# Altium schematic sheet TRISTATE_BANK.SchDoc
size 762 x 381 mm
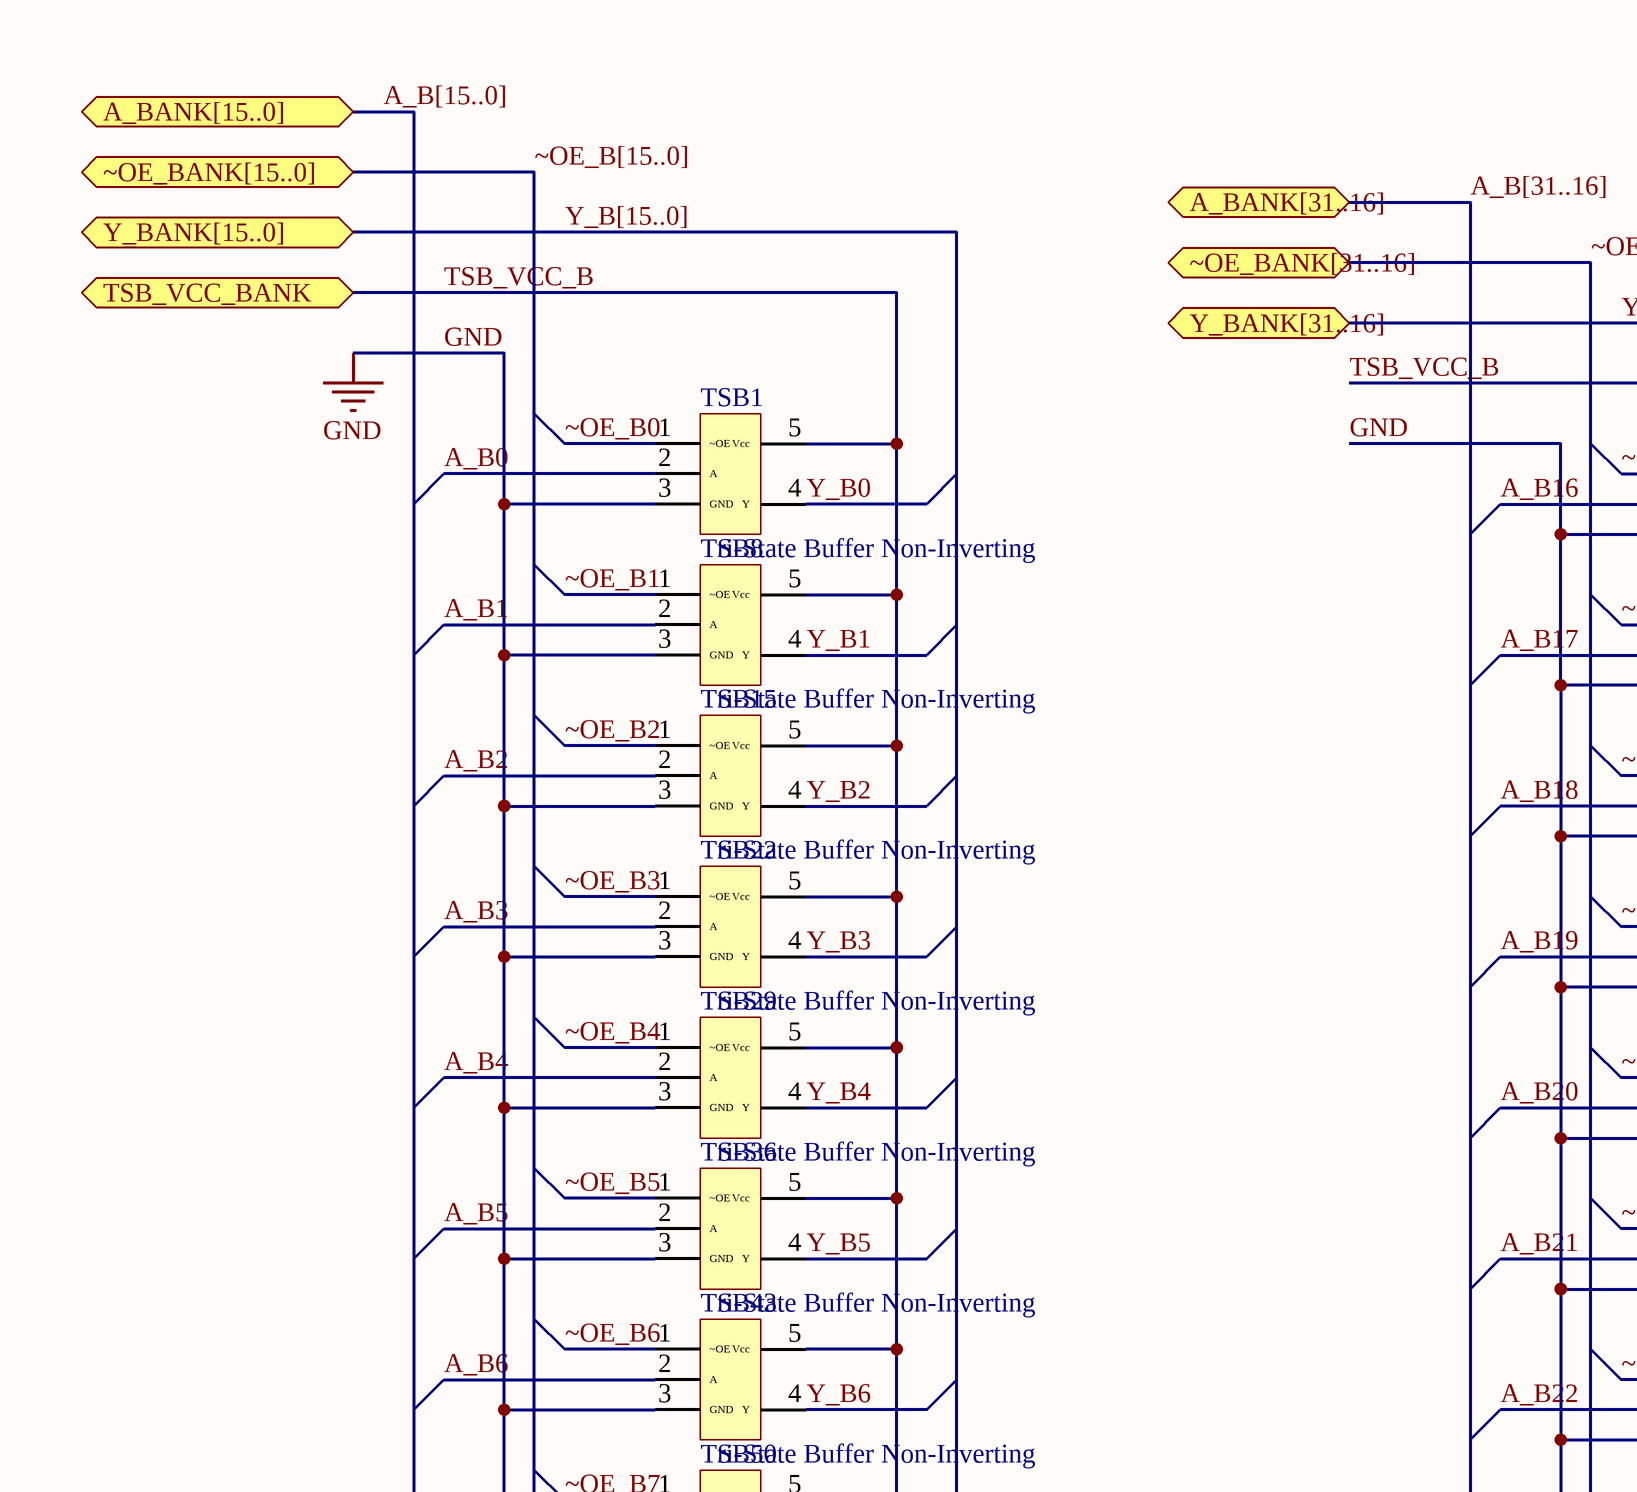
[diagram p0: TRISTATE_BANK.SchDoc, top column 1 of 5]
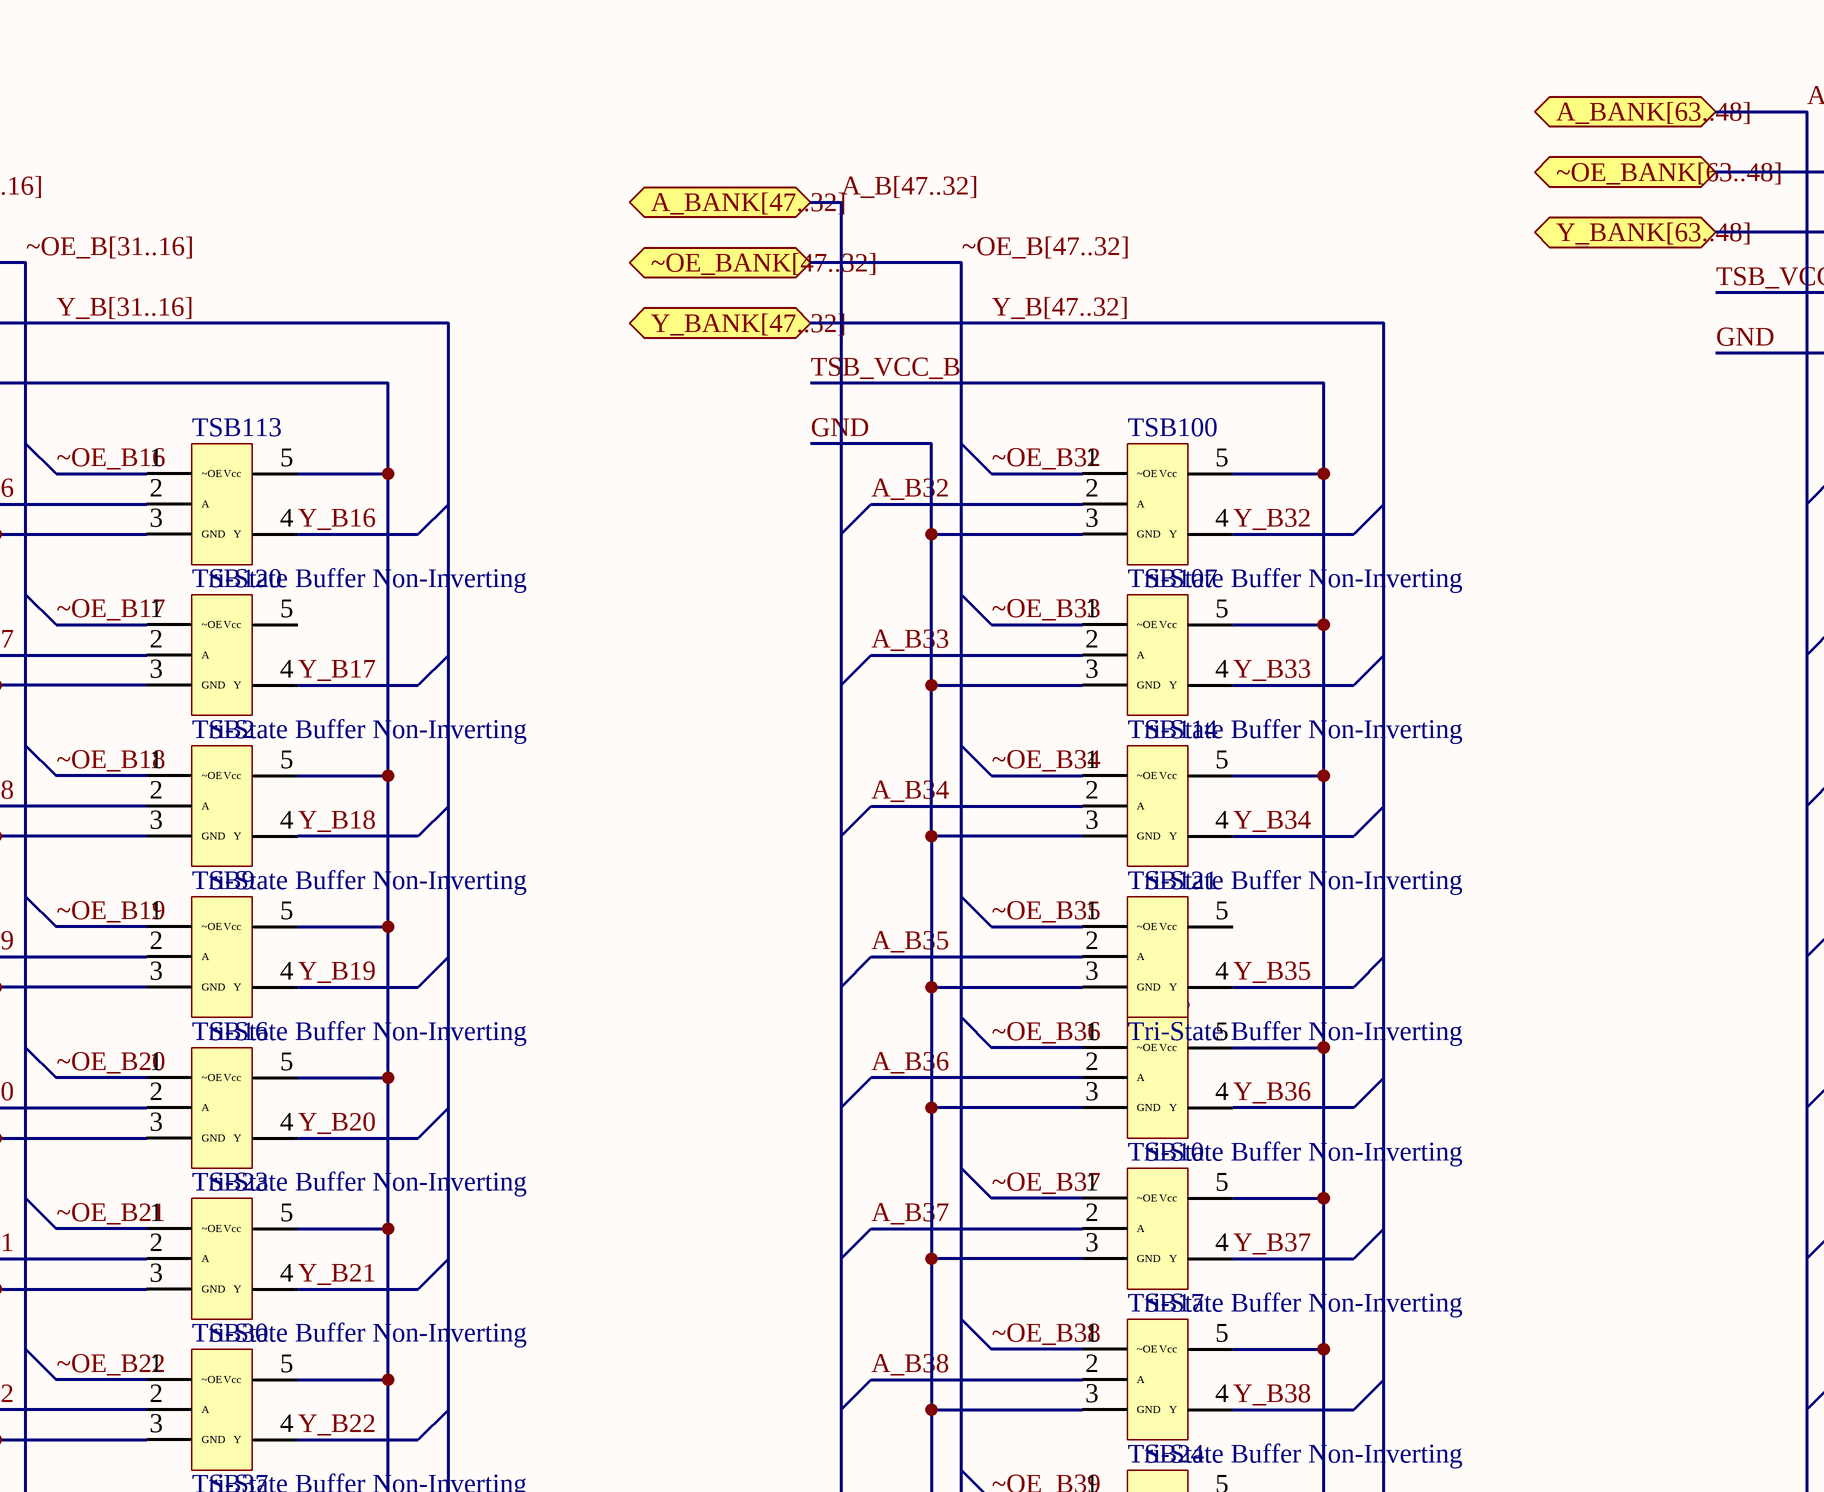
[diagram p1: TRISTATE_BANK.SchDoc, top column 2 of 5]
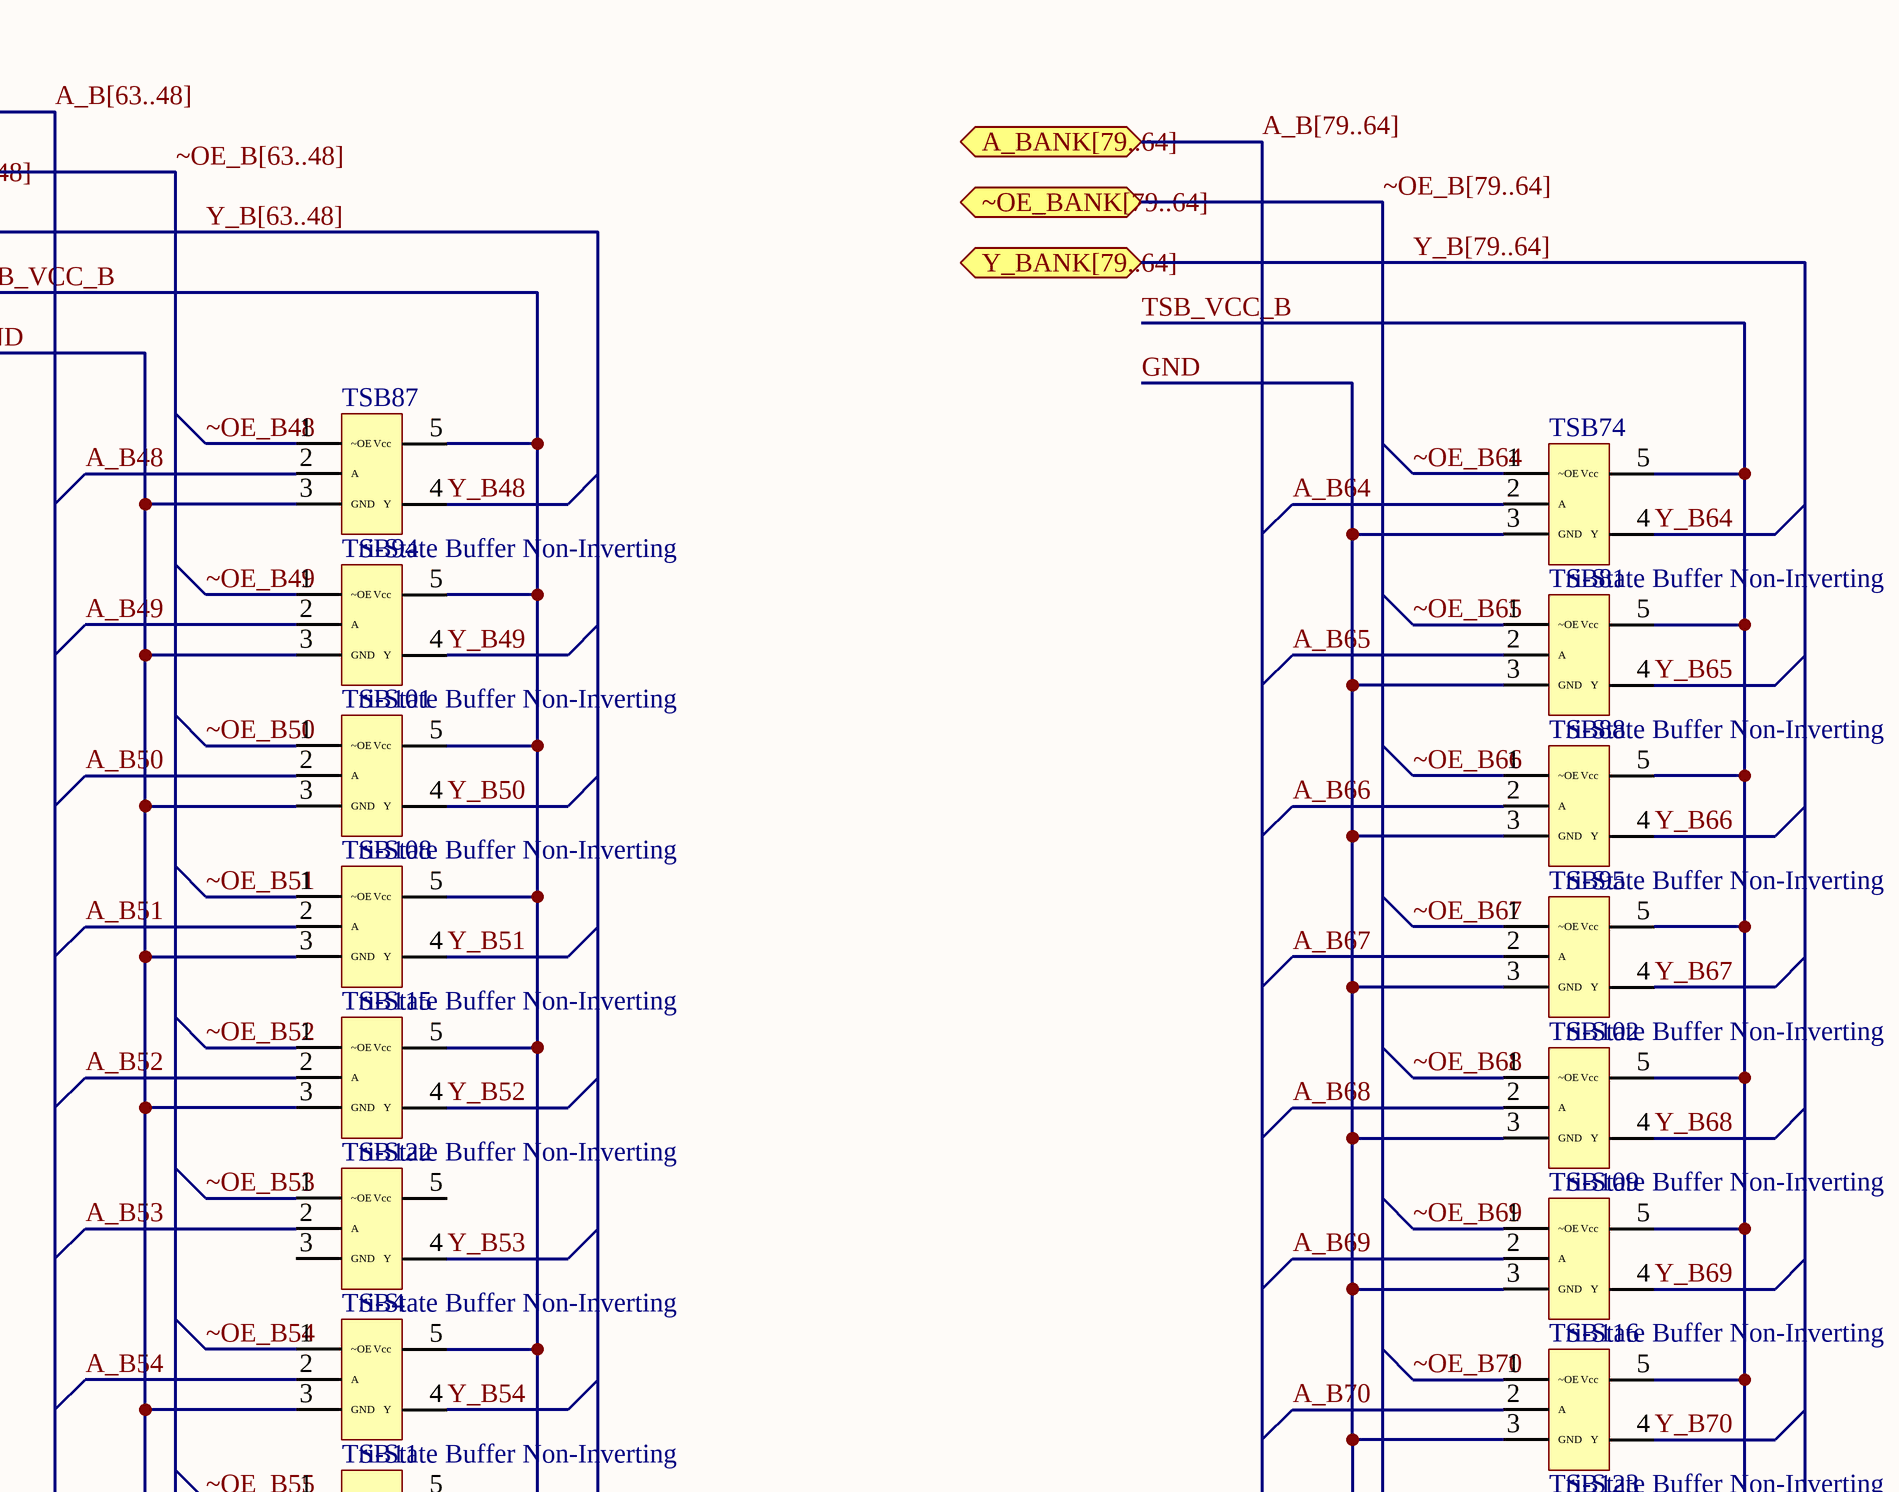
[diagram p2: TRISTATE_BANK.SchDoc, top column 3 of 5]
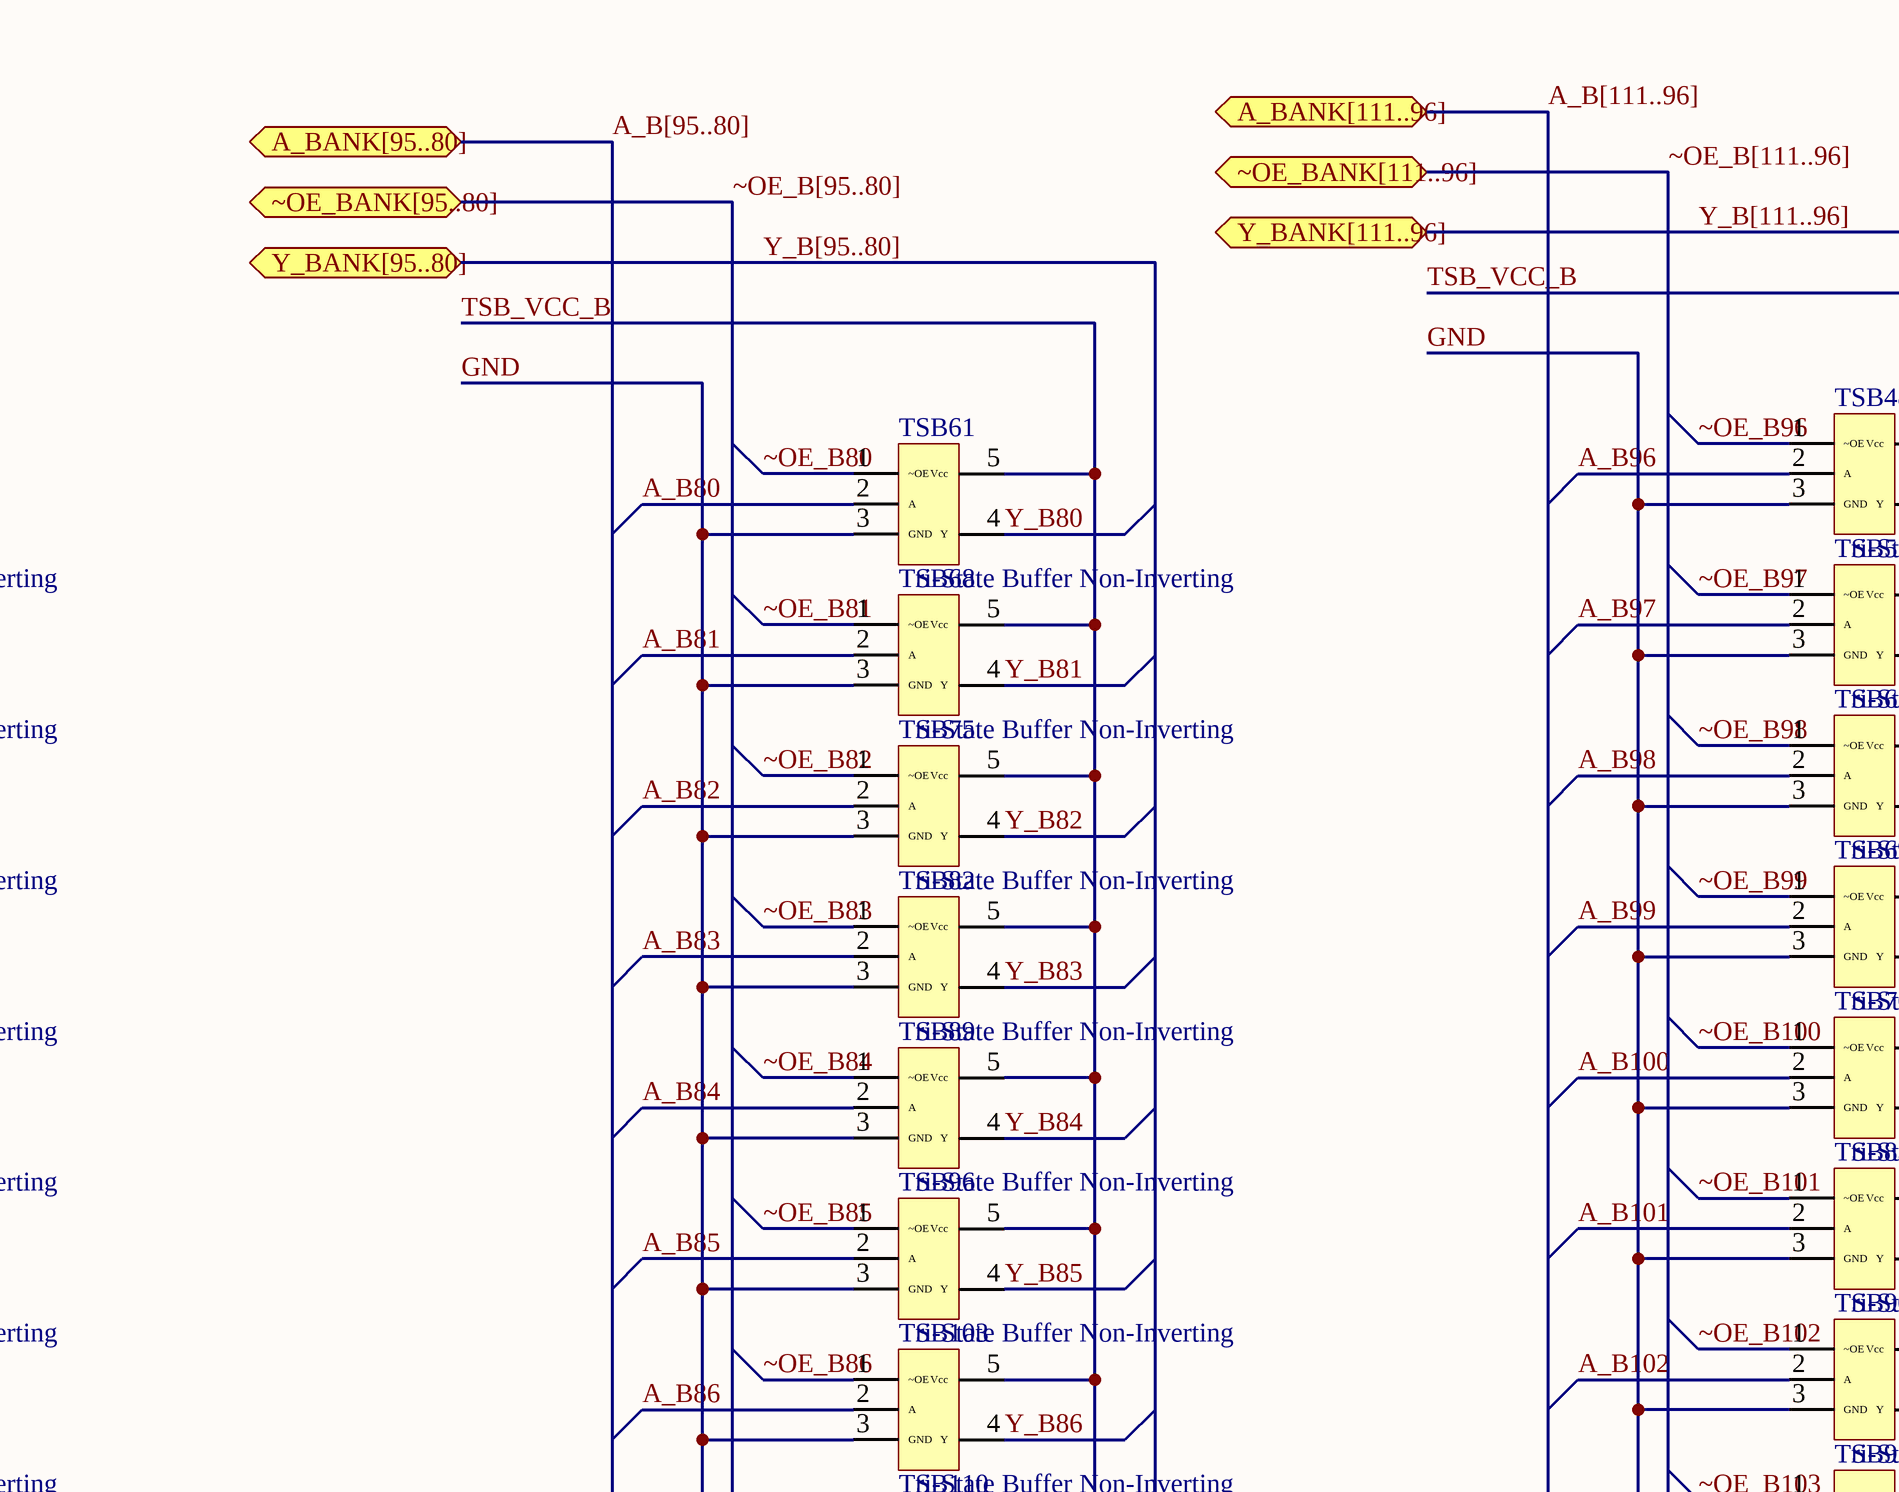
[diagram p3: TRISTATE_BANK.SchDoc, top column 4 of 5]
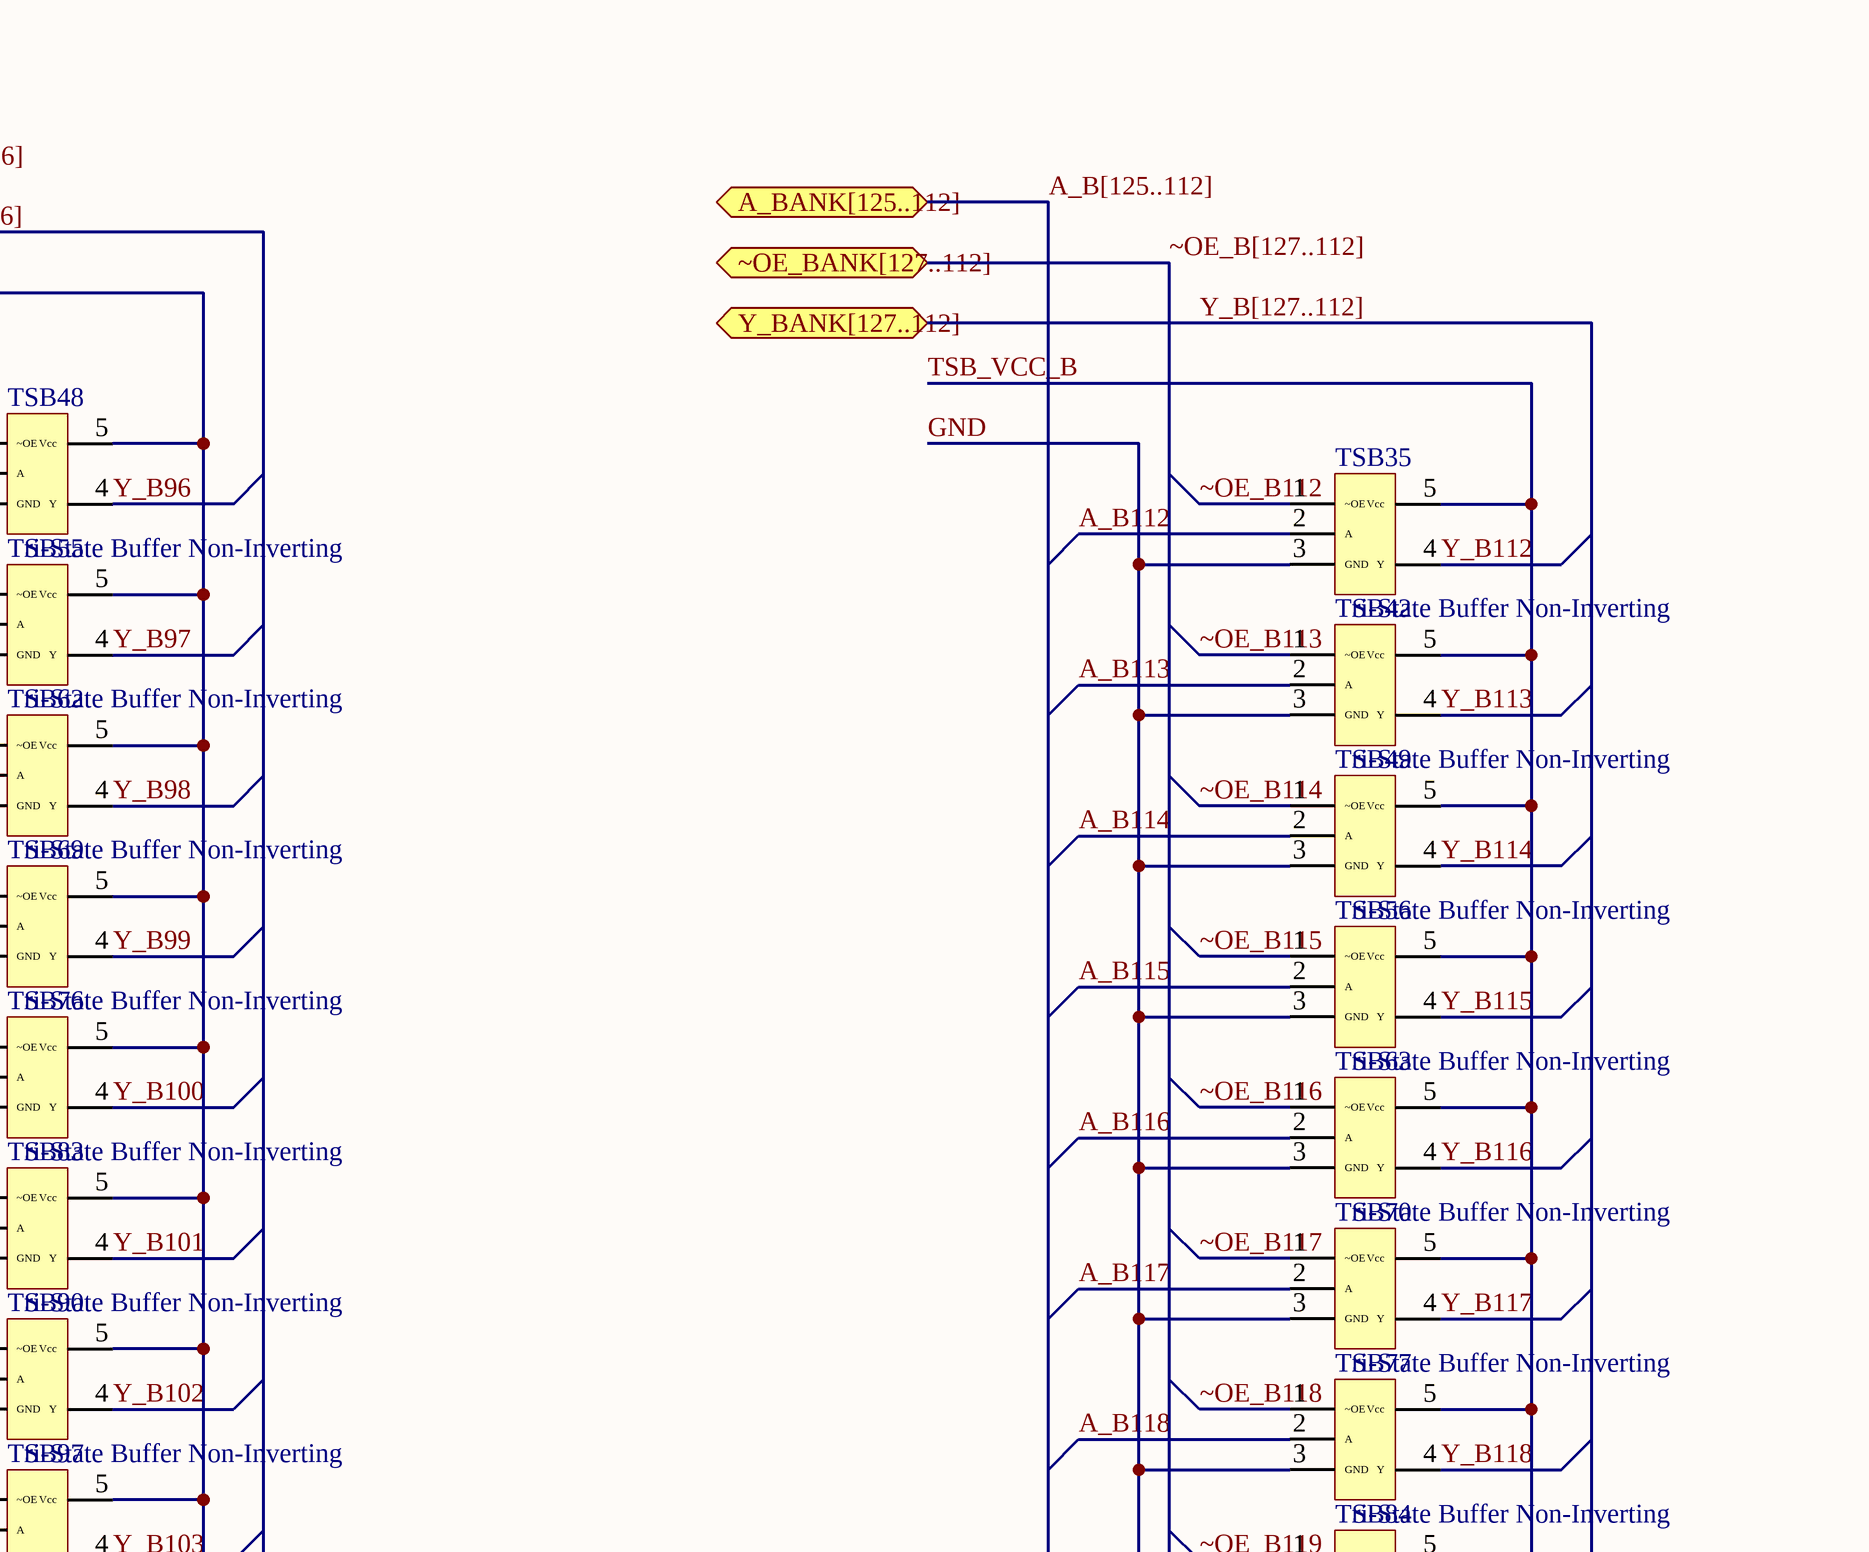
[diagram p4: TRISTATE_BANK.SchDoc, top column 5 of 5]
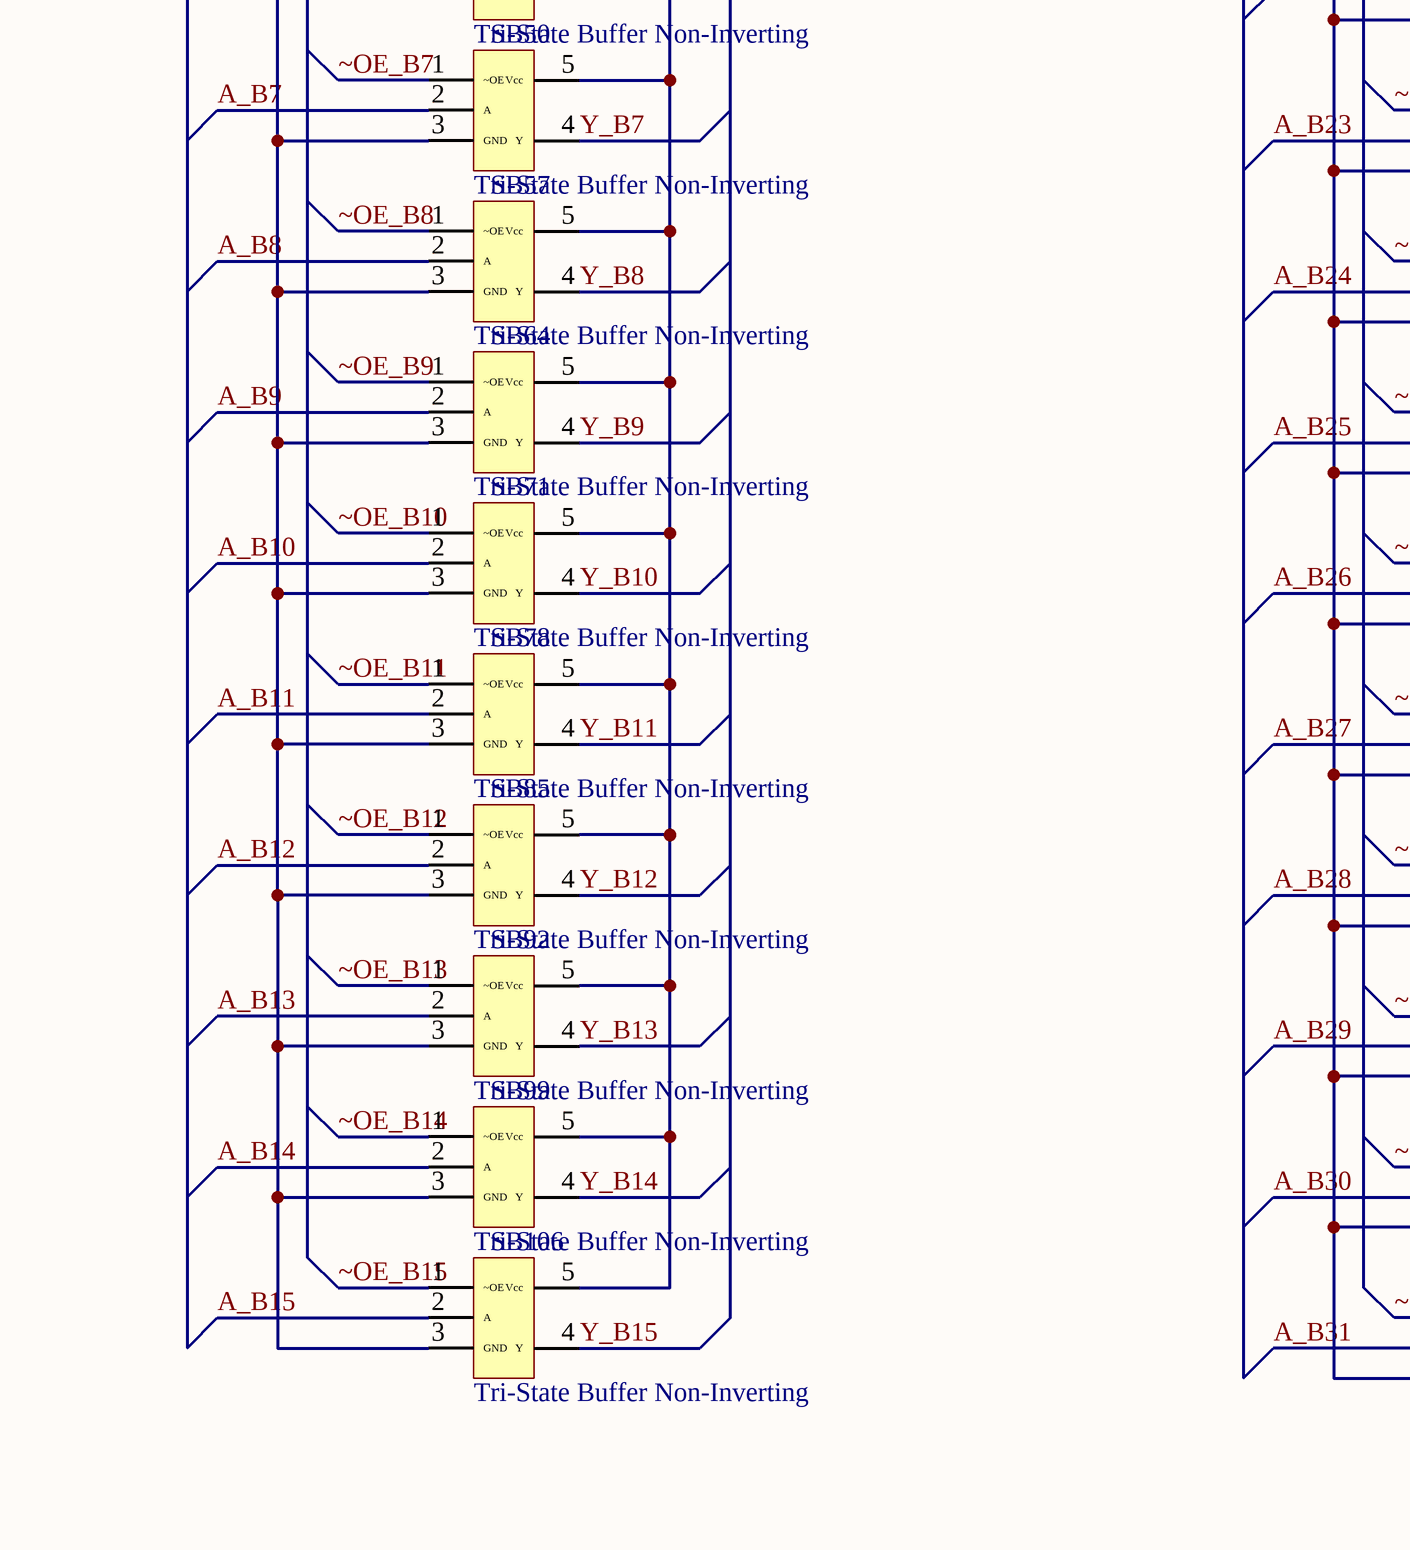
[diagram p5: TRISTATE_BANK.SchDoc, bottom column 1 of 5]
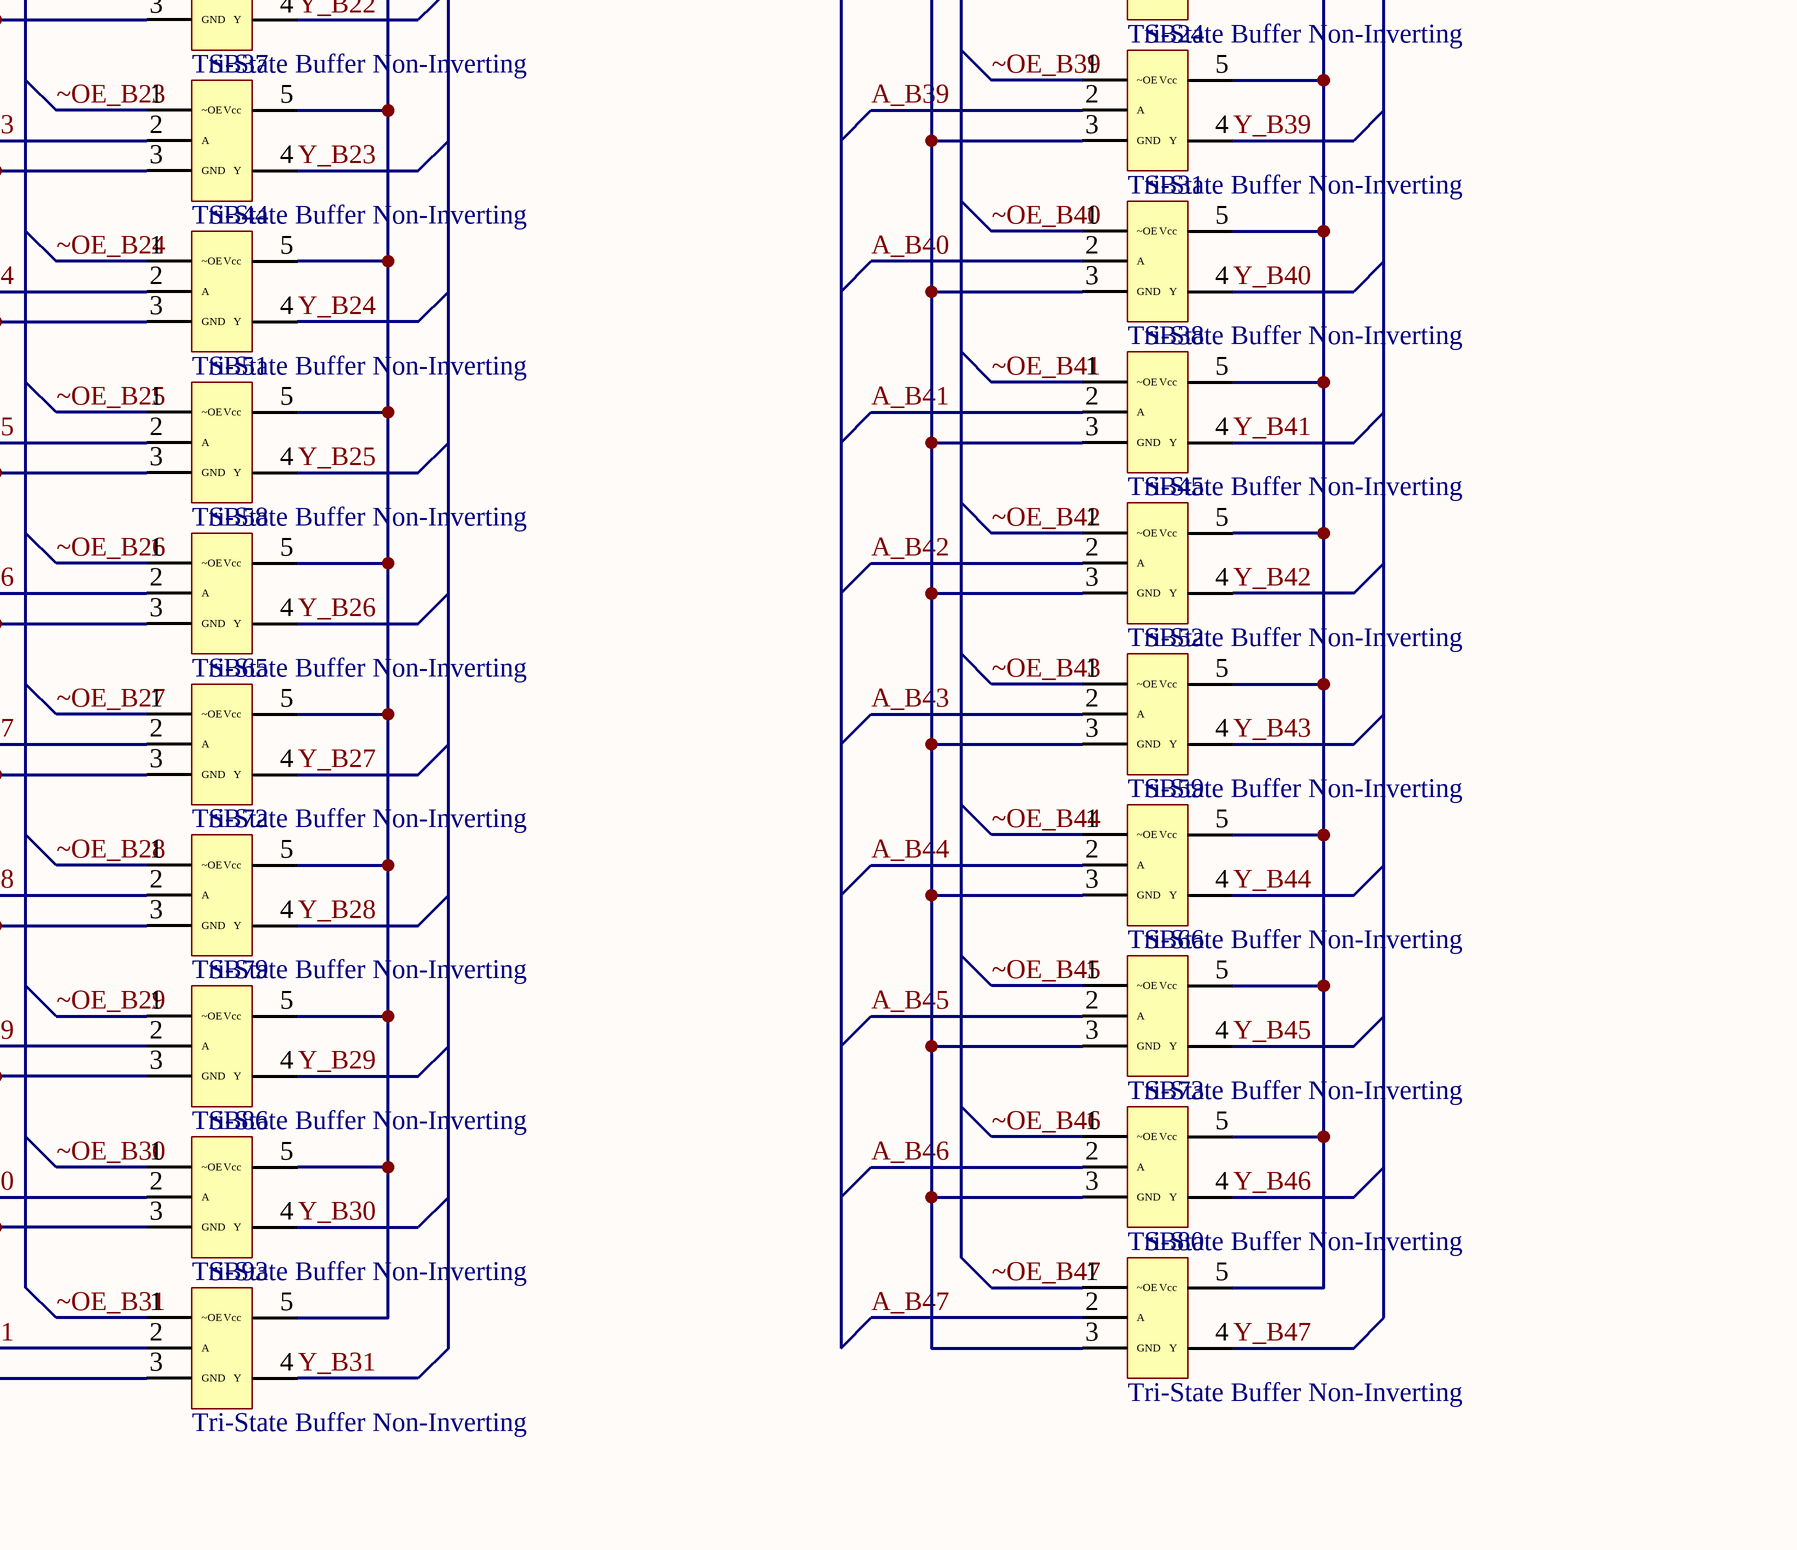
[diagram p6: TRISTATE_BANK.SchDoc, bottom column 2 of 5]
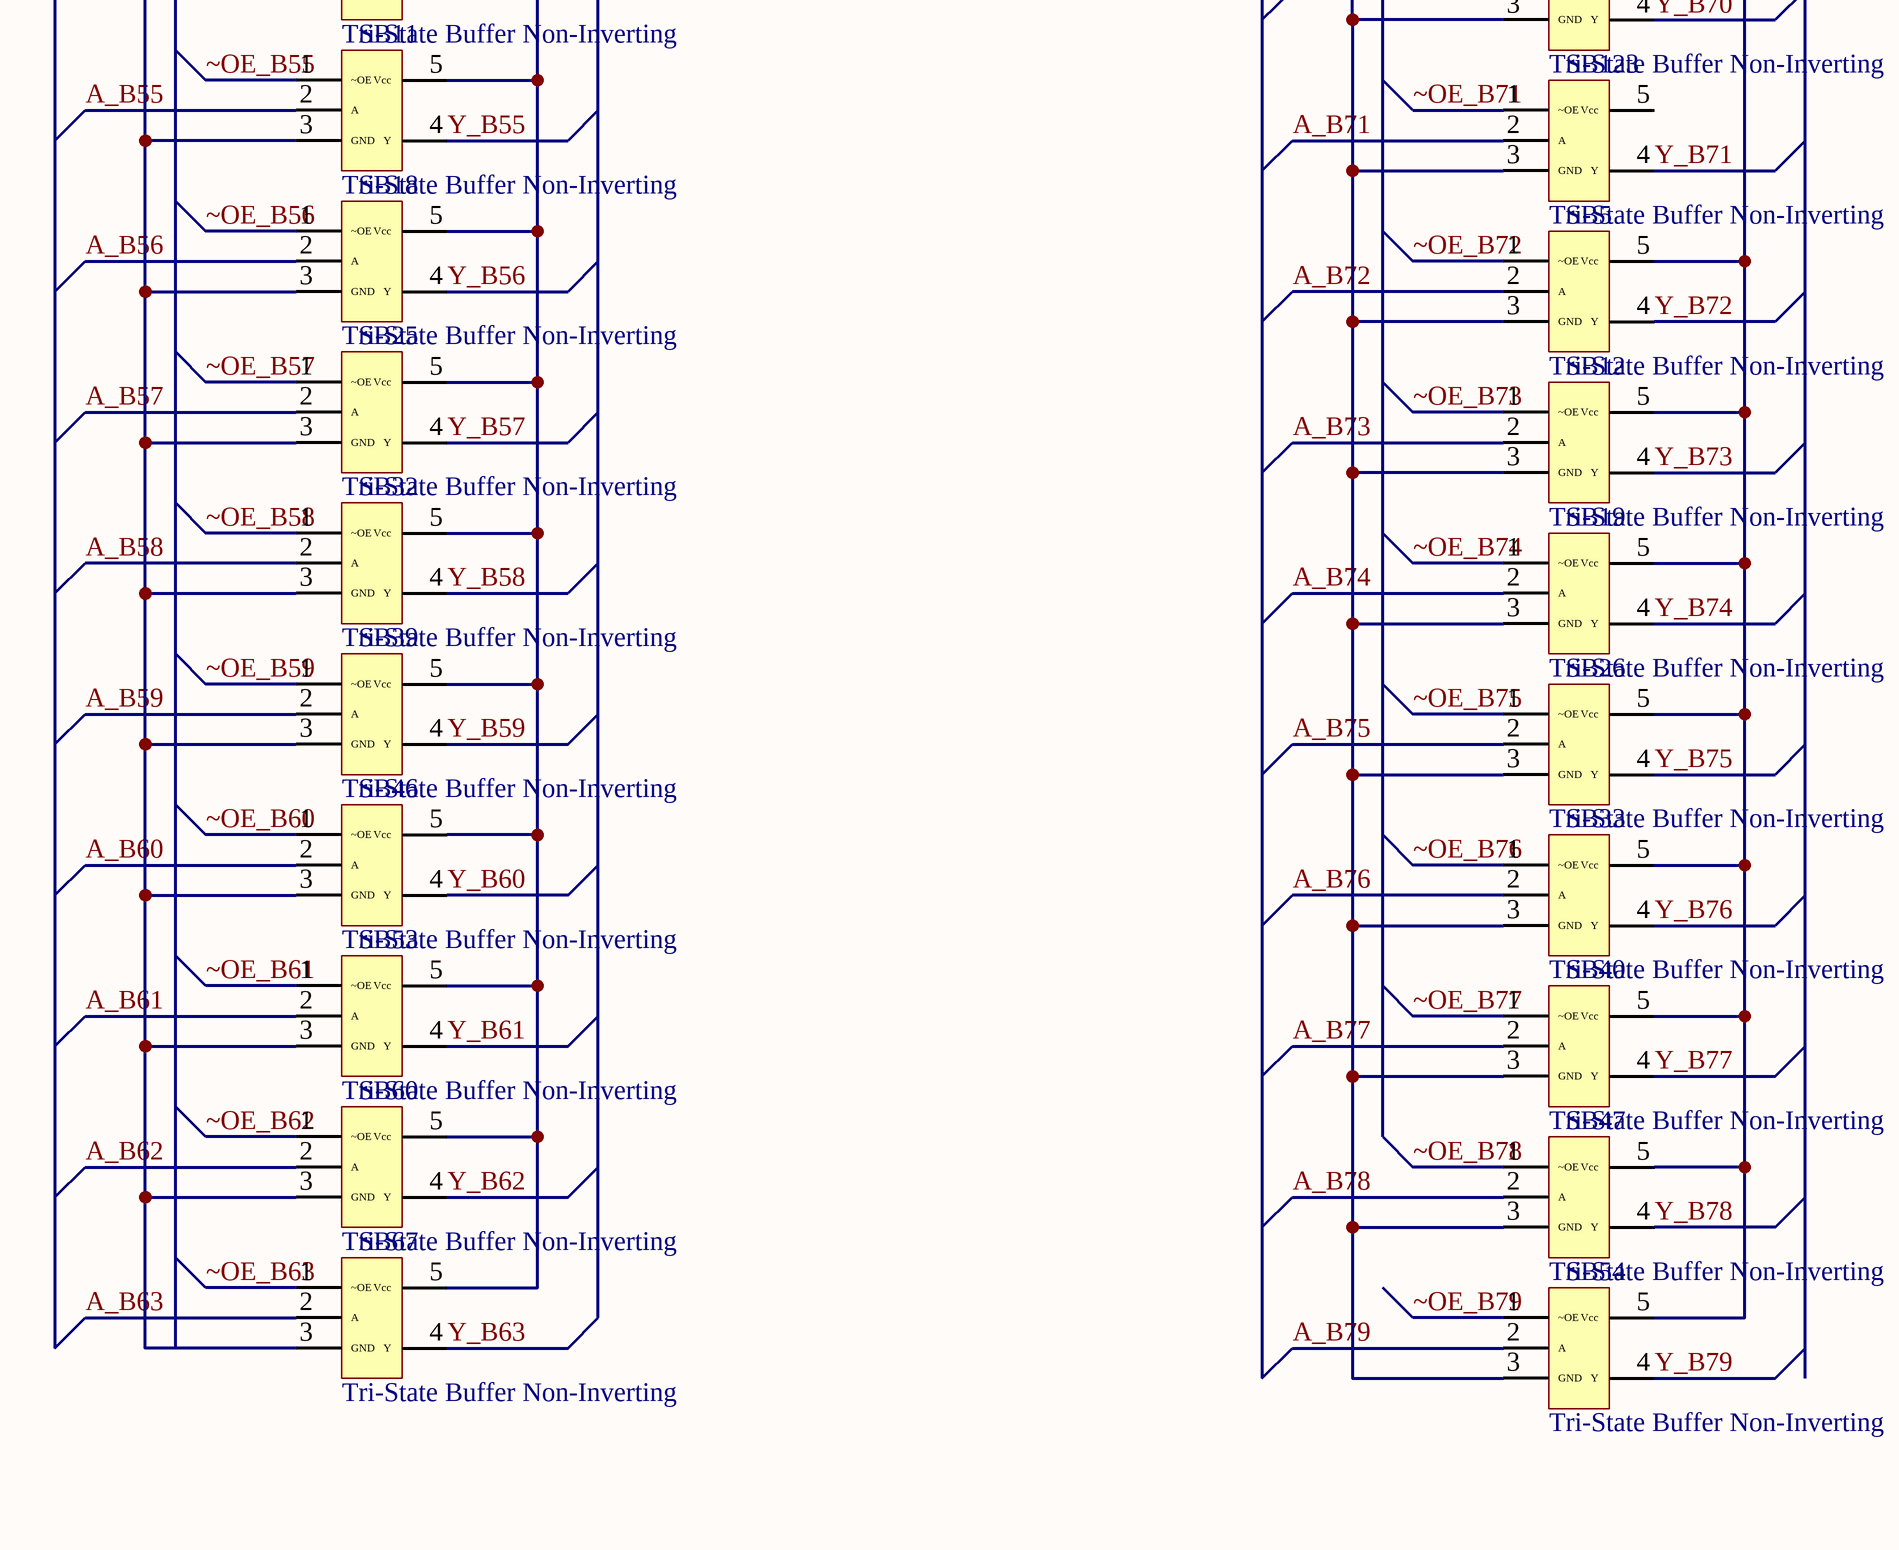
[diagram p7: TRISTATE_BANK.SchDoc, bottom column 3 of 5]
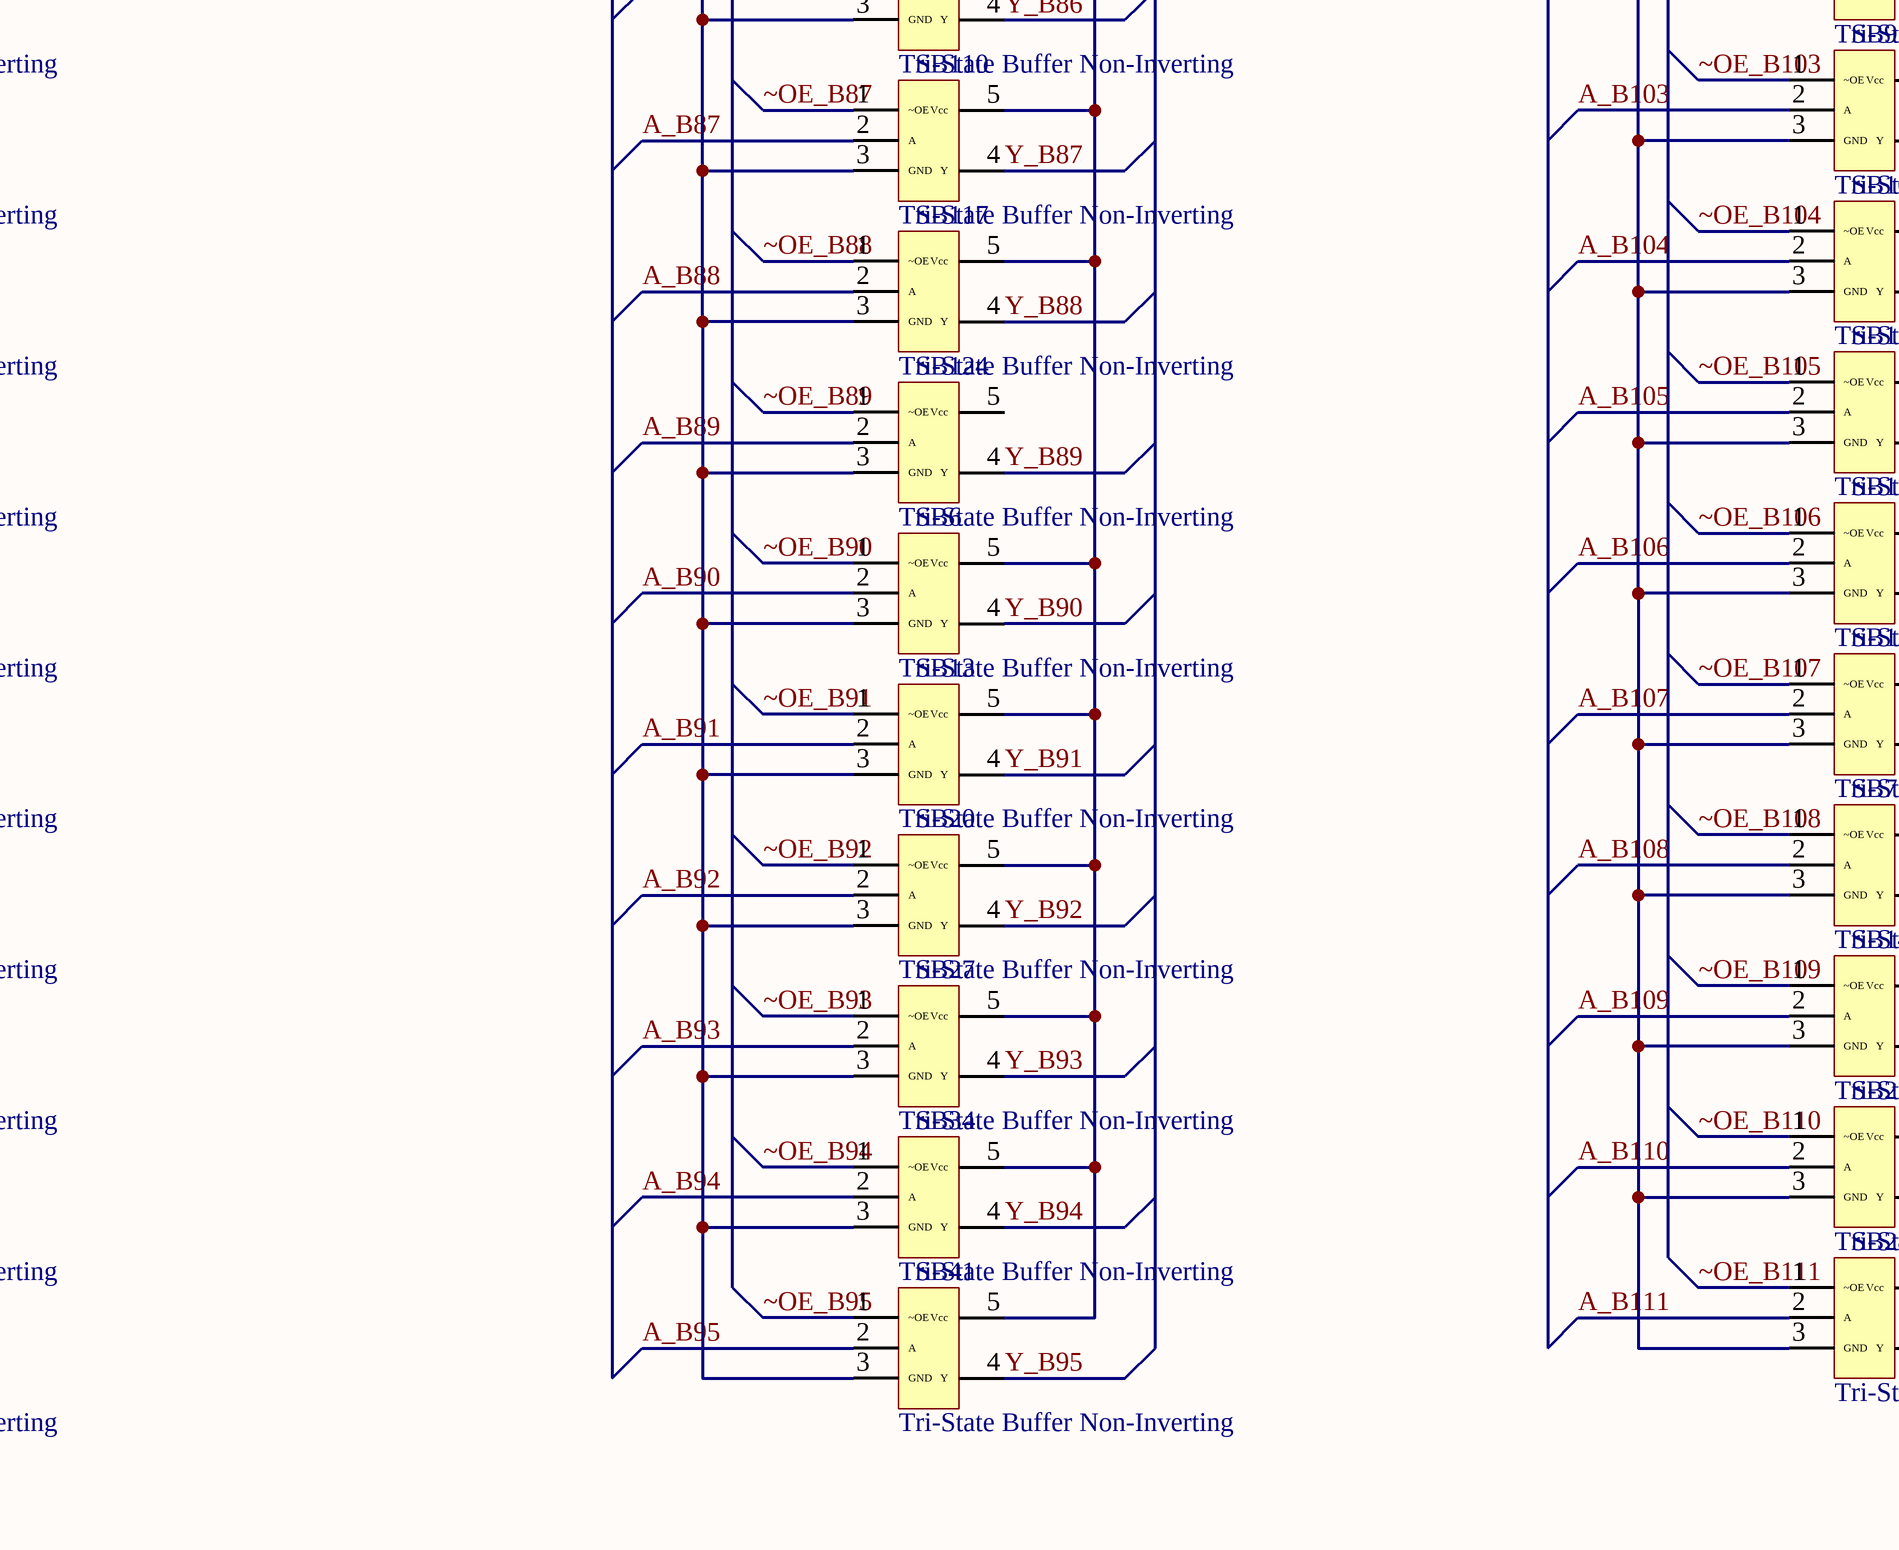
[diagram p8: TRISTATE_BANK.SchDoc, bottom column 4 of 5]
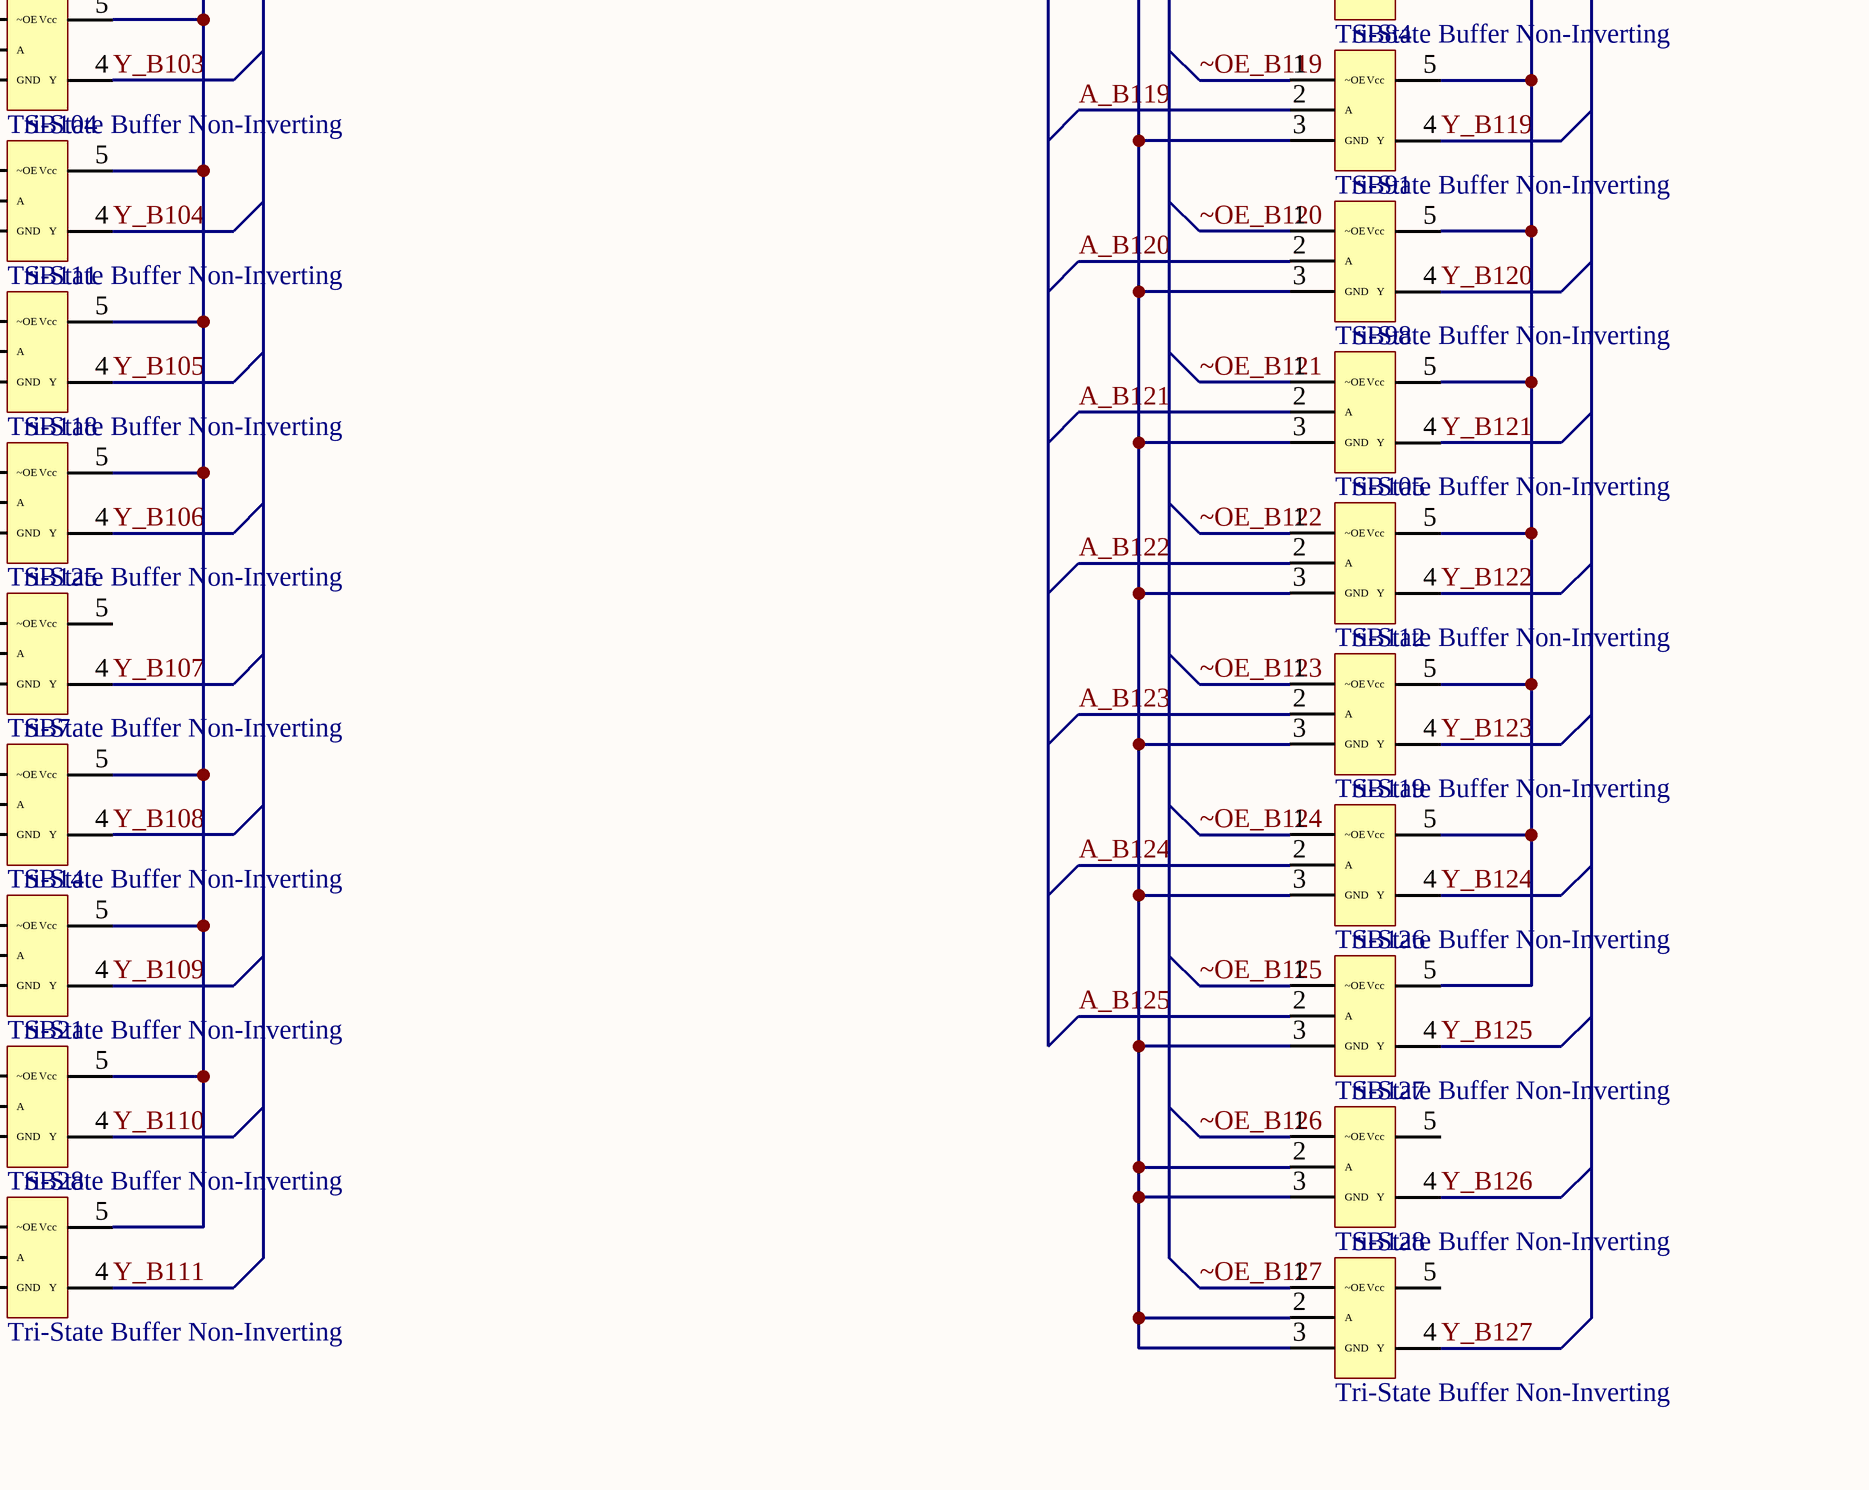
[diagram p9: TRISTATE_BANK.SchDoc, bottom column 5 of 5]

## Parts
TSB1  Tri-State Buffer Non-Inverting  [tri_state]
TSB2  Tri-State Buffer Non-Inverting  [tri_state]
TSB3  Tri-State Buffer Non-Inverting  [tri_state]
TSB4  Tri-State Buffer Non-Inverting  [tri_state]
TSB5  Tri-State Buffer Non-Inverting  [tri_state]
TSB6  Tri-State Buffer Non-Inverting  [tri_state]
TSB7  Tri-State Buffer Non-Inverting  [tri_state]
TSB8  Tri-State Buffer Non-Inverting  [tri_state]
TSB9  Tri-State Buffer Non-Inverting  [tri_state]
TSB10  Tri-State Buffer Non-Inverting  [tri_state]
TSB11  Tri-State Buffer Non-Inverting  [tri_state]
TSB12  Tri-State Buffer Non-Inverting  [tri_state]
TSB13  Tri-State Buffer Non-Inverting  [tri_state]
TSB14  Tri-State Buffer Non-Inverting  [tri_state]
TSB15  Tri-State Buffer Non-Inverting  [tri_state]
TSB16  Tri-State Buffer Non-Inverting  [tri_state]
TSB17  Tri-State Buffer Non-Inverting  [tri_state]
TSB18  Tri-State Buffer Non-Inverting  [tri_state]
TSB19  Tri-State Buffer Non-Inverting  [tri_state]
TSB20  Tri-State Buffer Non-Inverting  [tri_state]
TSB21  Tri-State Buffer Non-Inverting  [tri_state]
TSB22  Tri-State Buffer Non-Inverting  [tri_state]
TSB23  Tri-State Buffer Non-Inverting  [tri_state]
TSB24  Tri-State Buffer Non-Inverting  [tri_state]
TSB25  Tri-State Buffer Non-Inverting  [tri_state]
TSB26  Tri-State Buffer Non-Inverting  [tri_state]
TSB27  Tri-State Buffer Non-Inverting  [tri_state]
TSB28  Tri-State Buffer Non-Inverting  [tri_state]
TSB29  Tri-State Buffer Non-Inverting  [tri_state]
TSB30  Tri-State Buffer Non-Inverting  [tri_state]
TSB31  Tri-State Buffer Non-Inverting  [tri_state]
TSB32  Tri-State Buffer Non-Inverting  [tri_state]
TSB33  Tri-State Buffer Non-Inverting  [tri_state]
TSB34  Tri-State Buffer Non-Inverting  [tri_state]
TSB35  Tri-State Buffer Non-Inverting  [tri_state]
TSB36  Tri-State Buffer Non-Inverting  [tri_state]
TSB37  Tri-State Buffer Non-Inverting  [tri_state]
TSB38  Tri-State Buffer Non-Inverting  [tri_state]
TSB39  Tri-State Buffer Non-Inverting  [tri_state]
TSB40  Tri-State Buffer Non-Inverting  [tri_state]
TSB41  Tri-State Buffer Non-Inverting  [tri_state]
TSB42  Tri-State Buffer Non-Inverting  [tri_state]
TSB43  Tri-State Buffer Non-Inverting  [tri_state]
TSB44  Tri-State Buffer Non-Inverting  [tri_state]
TSB45  Tri-State Buffer Non-Inverting  [tri_state]
TSB46  Tri-State Buffer Non-Inverting  [tri_state]
TSB47  Tri-State Buffer Non-Inverting  [tri_state]
TSB48  Tri-State Buffer Non-Inverting  [tri_state]
TSB49  Tri-State Buffer Non-Inverting  [tri_state]
TSB50  Tri-State Buffer Non-Inverting  [tri_state]
TSB51  Tri-State Buffer Non-Inverting  [tri_state]
TSB52  Tri-State Buffer Non-Inverting  [tri_state]
TSB53  Tri-State Buffer Non-Inverting  [tri_state]
TSB54  Tri-State Buffer Non-Inverting  [tri_state]
TSB55  Tri-State Buffer Non-Inverting  [tri_state]
TSB56  Tri-State Buffer Non-Inverting  [tri_state]
TSB57  Tri-State Buffer Non-Inverting  [tri_state]
TSB58  Tri-State Buffer Non-Inverting  [tri_state]
TSB59  Tri-State Buffer Non-Inverting  [tri_state]
TSB60  Tri-State Buffer Non-Inverting  [tri_state]
TSB61  Tri-State Buffer Non-Inverting  [tri_state]
TSB62  Tri-State Buffer Non-Inverting  [tri_state]
TSB63  Tri-State Buffer Non-Inverting  [tri_state]
TSB64  Tri-State Buffer Non-Inverting  [tri_state]
TSB65  Tri-State Buffer Non-Inverting  [tri_state]
TSB66  Tri-State Buffer Non-Inverting  [tri_state]
TSB67  Tri-State Buffer Non-Inverting  [tri_state]
TSB68  Tri-State Buffer Non-Inverting  [tri_state]
TSB69  Tri-State Buffer Non-Inverting  [tri_state]
TSB70  Tri-State Buffer Non-Inverting  [tri_state]
TSB71  Tri-State Buffer Non-Inverting  [tri_state]
TSB72  Tri-State Buffer Non-Inverting  [tri_state]
TSB73  Tri-State Buffer Non-Inverting  [tri_state]
TSB74  Tri-State Buffer Non-Inverting  [tri_state]
TSB75  Tri-State Buffer Non-Inverting  [tri_state]
TSB76  Tri-State Buffer Non-Inverting  [tri_state]
TSB77  Tri-State Buffer Non-Inverting  [tri_state]
TSB78  Tri-State Buffer Non-Inverting  [tri_state]
TSB79  Tri-State Buffer Non-Inverting  [tri_state]
TSB80  Tri-State Buffer Non-Inverting  [tri_state]
TSB81  Tri-State Buffer Non-Inverting  [tri_state]
TSB82  Tri-State Buffer Non-Inverting  [tri_state]
TSB83  Tri-State Buffer Non-Inverting  [tri_state]
TSB84  Tri-State Buffer Non-Inverting  [tri_state]
TSB85  Tri-State Buffer Non-Inverting  [tri_state]
TSB86  Tri-State Buffer Non-Inverting  [tri_state]
TSB87  Tri-State Buffer Non-Inverting  [tri_state]
TSB88  Tri-State Buffer Non-Inverting  [tri_state]
TSB89  Tri-State Buffer Non-Inverting  [tri_state]
TSB90  Tri-State Buffer Non-Inverting  [tri_state]
TSB91  Tri-State Buffer Non-Inverting  [tri_state]
TSB92  Tri-State Buffer Non-Inverting  [tri_state]
TSB93  Tri-State Buffer Non-Inverting  [tri_state]
TSB94  Tri-State Buffer Non-Inverting  [tri_state]
TSB95  Tri-State Buffer Non-Inverting  [tri_state]
TSB96  Tri-State Buffer Non-Inverting  [tri_state]
TSB97  Tri-State Buffer Non-Inverting  [tri_state]
TSB98  Tri-State Buffer Non-Inverting  [tri_state]
TSB99  Tri-State Buffer Non-Inverting  [tri_state]
TSB100  Tri-State Buffer Non-Inverting  [tri_state]
TSB101  Tri-State Buffer Non-Inverting  [tri_state]
TSB102  Tri-State Buffer Non-Inverting  [tri_state]
TSB103  Tri-State Buffer Non-Inverting  [tri_state]
TSB104  Tri-State Buffer Non-Inverting  [tri_state]
TSB105  Tri-State Buffer Non-Inverting  [tri_state]
TSB106  Tri-State Buffer Non-Inverting  [tri_state]
TSB107  Tri-State Buffer Non-Inverting  [tri_state]
TSB108  Tri-State Buffer Non-Inverting  [tri_state]
TSB109  Tri-State Buffer Non-Inverting  [tri_state]
TSB110  Tri-State Buffer Non-Inverting  [tri_state]
TSB111  Tri-State Buffer Non-Inverting  [tri_state]
TSB112  Tri-State Buffer Non-Inverting  [tri_state]
TSB113  Tri-State Buffer Non-Inverting  [tri_state]
TSB114  Tri-State Buffer Non-Inverting  [tri_state]
TSB115  Tri-State Buffer Non-Inverting  [tri_state]
TSB116  Tri-State Buffer Non-Inverting  [tri_state]
TSB117  Tri-State Buffer Non-Inverting  [tri_state]
TSB118  Tri-State Buffer Non-Inverting  [tri_state]
TSB119  Tri-State Buffer Non-Inverting  [tri_state]
TSB120  Tri-State Buffer Non-Inverting  [tri_state]
TSB121  Tri-State Buffer Non-Inverting  [tri_state]
TSB122  Tri-State Buffer Non-Inverting  [tri_state]
TSB123  Tri-State Buffer Non-Inverting  [tri_state]
TSB124  Tri-State Buffer Non-Inverting  [tri_state]
TSB125  Tri-State Buffer Non-Inverting  [tri_state]
TSB126  Tri-State Buffer Non-Inverting  [tri_state]
TSB127  Tri-State Buffer Non-Inverting  [tri_state]
TSB128  Tri-State Buffer Non-Inverting  [tri_state]

## Ports
A_BANK[15..0], A_BANK[31..16], A_BANK[47..32], A_BANK[63..48], A_BANK[79..64], A_BANK[95..80], A_BANK[111..96], A_BANK[125..112], TSB_VCC_BANK, Y_BANK[15..0], Y_BANK[31..16], Y_BANK[47..32], Y_BANK[63..48], Y_BANK[79..64], Y_BANK[95..80], Y_BANK[111..96], Y_BANK[127..112], ~OE_BANK[15..0], ~OE_BANK[31..16], ~OE_BANK[47..32], ~OE_BANK[63..48], ~OE_BANK[79..64], ~OE_BANK[95..80], ~OE_BANK[111..96], ~OE_BANK[127..112]

## Nets
GND: TSB1.3(GND) TSB2.3(GND) TSB3.3(GND) TSB4.3(GND) TSB5.3(GND) TSB6.3(GND) TSB7.3(GND) TSB8.3(GND) TSB9.3(GND) TSB10.3(GND) TSB11.3(GND) TSB12.3(GND) TSB13.3(GND) TSB14.3(GND) TSB15.3(GND) TSB16.3(GND) TSB17.3(GND) TSB18.3(GND) TSB19.3(GND) TSB20.3(GND) TSB21.3(GND) TSB22.3(GND) TSB23.3(GND) TSB24.3(GND) TSB25.3(GND) TSB26.3(GND) TSB27.3(GND) TSB28.3(GND) TSB29.3(GND) TSB30.3(GND) TSB31.3(GND) TSB32.3(GND) TSB33.3(GND) TSB34.3(GND) TSB35.3(GND) TSB36.3(GND) TSB37.3(GND) TSB38.3(GND) TSB39.3(GND) TSB40.3(GND) TSB41.3(GND) TSB42.3(GND) TSB43.3(GND) TSB44.3(GND) TSB45.3(GND) TSB46.3(GND) TSB47.3(GND) TSB48.3(GND) TSB49.3(GND) TSB50.3(GND) TSB51.3(GND) TSB52.3(GND) TSB53.3(GND) TSB54.3(GND) TSB55.3(GND) TSB56.3(GND) TSB57.3(GND) TSB58.3(GND) TSB59.3(GND) TSB60.3(GND) TSB61.3(GND) TSB62.3(GND) TSB63.3(GND) TSB64.3(GND) TSB65.3(GND) TSB66.3(GND) TSB67.3(GND) TSB68.3(GND) TSB69.3(GND) TSB70.3(GND) TSB71.3(GND) TSB72.3(GND) TSB73.3(GND) TSB74.3(GND) TSB75.3(GND) TSB76.3(GND) TSB77.3(GND) TSB78.3(GND) TSB79.3(GND) TSB80.3(GND) TSB81.3(GND) TSB82.3(GND) TSB83.3(GND) TSB84.3(GND) TSB85.3(GND) TSB86.3(GND) TSB87.3(GND) TSB88.3(GND) TSB89.3(GND) TSB90.3(GND) TSB91.3(GND) TSB92.3(GND) TSB93.3(GND) TSB94.3(GND) TSB95.3(GND) TSB96.3(GND) TSB97.3(GND) TSB98.3(GND) TSB99.3(GND) TSB100.3(GND) TSB101.3(GND) TSB102.3(GND) TSB103.3(GND) TSB104.3(GND) TSB105.3(GND) TSB106.3(GND) TSB107.3(GND) TSB108.3(GND) TSB109.3(GND) TSB110.3(GND) TSB111.3(GND) TSB112.3(GND) TSB113.3(GND) TSB114.3(GND) TSB115.3(GND) TSB116.3(GND) TSB117.3(GND) TSB118.3(GND) TSB119.3(GND) TSB120.3(GND) TSB121.3(GND) TSB123.3(GND) TSB124.3(GND) TSB125.3(GND) TSB126.3(GND) TSB127.2(A) TSB127.3(GND) TSB128.2(A) TSB128.3(GND)
A_B0: TSB1.2(A)
A_B1: TSB8.2(A)
A_B2: TSB15.2(A)
A_B3: TSB22.2(A)
A_B4: TSB29.2(A)
A_B5: TSB36.2(A)
A_B6: TSB43.2(A)
A_B7: TSB50.2(A)
A_B8: TSB57.2(A)
A_B9: TSB64.2(A)
A_B10: TSB71.2(A)
A_B11: TSB78.2(A)
A_B12: TSB85.2(A)
A_B13: TSB92.2(A)
A_B14: TSB99.2(A)
A_B15: TSB106.2(A)
A_B16: TSB113.2(A)
A_B17: TSB120.2(A)
A_B18: TSB2.2(A)
A_B19: TSB9.2(A)
A_B20: TSB16.2(A)
A_B21: TSB23.2(A)
A_B22: TSB30.2(A)
A_B23: TSB37.2(A)
A_B24: TSB44.2(A)
A_B25: TSB51.2(A)
A_B26: TSB58.2(A)
A_B27: TSB65.2(A)
A_B28: TSB72.2(A)
A_B29: TSB79.2(A)
A_B30: TSB86.2(A)
A_B31: TSB93.2(A)
A_B32: TSB100.2(A)
A_B33: TSB107.2(A)
A_B34: TSB114.2(A)
A_B35: TSB121.2(A)
A_B36: TSB3.2(A)
A_B37: TSB10.2(A)
A_B38: TSB17.2(A)
A_B39: TSB24.2(A)
A_B40: TSB31.2(A)
A_B41: TSB38.2(A)
A_B42: TSB45.2(A)
A_B43: TSB52.2(A)
A_B44: TSB59.2(A)
A_B45: TSB66.2(A)
A_B46: TSB73.2(A)
A_B47: TSB80.2(A)
A_B48: TSB87.2(A)
A_B49: TSB94.2(A)
A_B50: TSB101.2(A)
A_B51: TSB108.2(A)
A_B52: TSB115.2(A)
A_B53: TSB122.2(A)
A_B54: TSB4.2(A)
A_B55: TSB11.2(A)
A_B56: TSB18.2(A)
A_B57: TSB25.2(A)
A_B58: TSB32.2(A)
A_B59: TSB39.2(A)
A_B60: TSB46.2(A)
A_B61: TSB53.2(A)
A_B62: TSB60.2(A)
A_B63: TSB67.2(A)
A_B64: TSB74.2(A)
A_B65: TSB81.2(A)
A_B66: TSB88.2(A)
A_B67: TSB95.2(A)
A_B68: TSB102.2(A)
A_B69: TSB109.2(A)
A_B70: TSB116.2(A)
A_B71: TSB123.2(A)
A_B72: TSB5.2(A)
A_B73: TSB12.2(A)
A_B74: TSB19.2(A)
A_B75: TSB26.2(A)
A_B76: TSB33.2(A)
A_B77: TSB40.2(A)
A_B78: TSB47.2(A)
A_B79: TSB54.2(A)
A_B80: TSB61.2(A)
A_B81: TSB68.2(A)
A_B82: TSB75.2(A)
A_B83: TSB82.2(A)
A_B84: TSB89.2(A)
A_B85: TSB96.2(A)
A_B86: TSB103.2(A)
A_B87: TSB110.2(A)
A_B88: TSB117.2(A)
A_B89: TSB124.2(A)
A_B90: TSB6.2(A)
A_B91: TSB13.2(A)
A_B92: TSB20.2(A)
A_B93: TSB27.2(A)
A_B94: TSB34.2(A)
A_B95: TSB41.2(A)
A_B96: TSB48.2(A)
A_B97: TSB55.2(A)
A_B98: TSB62.2(A)
A_B99: TSB69.2(A)
A_B100: TSB76.2(A)
A_B101: TSB83.2(A)
A_B102: TSB90.2(A)
A_B103: TSB97.2(A)
A_B104: TSB104.2(A)
A_B105: TSB111.2(A)
A_B106: TSB118.2(A)
A_B107: TSB125.2(A)
A_B108: TSB7.2(A)
A_B109: TSB14.2(A)
A_B110: TSB21.2(A)
A_B111: TSB28.2(A)
A_B112: TSB35.2(A)
A_B113: TSB42.2(A)
A_B114: TSB49.2(A)
A_B115: TSB56.2(A)
A_B116: TSB63.2(A)
A_B117: TSB70.2(A)
A_B118: TSB77.2(A)
A_B119: TSB84.2(A)
A_B120: TSB91.2(A)
A_B121: TSB98.2(A)
A_B122: TSB105.2(A)
A_B123: TSB112.2(A)
A_B124: TSB119.2(A)
A_B125: TSB126.2(A)
TSB_VCC_B: TSB1.5(Vcc) TSB2.5(Vcc) TSB3.5(Vcc) TSB4.5(Vcc) TSB5.5(Vcc) TSB6.5(Vcc) TSB7.5(Vcc) TSB8.5(Vcc) TSB9.5(Vcc) TSB10.5(Vcc) TSB11.5(Vcc) TSB12.5(Vcc) TSB13.5(Vcc) TSB14.5(Vcc) TSB15.5(Vcc) TSB16.5(Vcc) TSB17.5(Vcc) TSB18.5(Vcc) TSB19.5(Vcc) TSB20.5(Vcc) TSB21.5(Vcc) TSB22.5(Vcc) TSB23.5(Vcc) TSB24.5(Vcc) TSB25.5(Vcc) TSB26.5(Vcc) TSB27.5(Vcc) TSB28.5(Vcc) TSB29.5(Vcc) TSB30.5(Vcc) TSB31.5(Vcc) TSB32.5(Vcc) TSB33.5(Vcc) TSB34.5(Vcc) TSB35.5(Vcc) TSB36.5(Vcc) TSB37.5(Vcc) TSB38.5(Vcc) TSB39.5(Vcc) TSB40.5(Vcc) TSB41.5(Vcc) TSB42.5(Vcc) TSB43.5(Vcc) TSB44.5(Vcc) TSB45.5(Vcc) TSB46.5(Vcc) TSB47.5(Vcc) TSB48.5(Vcc) TSB49.5(Vcc) TSB50.5(Vcc) TSB51.5(Vcc) TSB52.5(Vcc) TSB53.5(Vcc) TSB54.5(Vcc) TSB55.5(Vcc) TSB56.5(Vcc) TSB57.5(Vcc) TSB58.5(Vcc) TSB59.5(Vcc) TSB60.5(Vcc) TSB61.5(Vcc) TSB62.5(Vcc) TSB63.5(Vcc) TSB64.5(Vcc) TSB65.5(Vcc) TSB66.5(Vcc) TSB67.5(Vcc) TSB68.5(Vcc) TSB69.5(Vcc) TSB70.5(Vcc) TSB71.5(Vcc) TSB72.5(Vcc) TSB73.5(Vcc) TSB74.5(Vcc) TSB75.5(Vcc) TSB76.5(Vcc) TSB77.5(Vcc) TSB78.5(Vcc) TSB79.5(Vcc) TSB80.5(Vcc) TSB81.5(Vcc) TSB82.5(Vcc) TSB83.5(Vcc) TSB84.5(Vcc) TSB85.5(Vcc) TSB86.5(Vcc) TSB87.5(Vcc) TSB88.5(Vcc) TSB89.5(Vcc) TSB90.5(Vcc) TSB91.5(Vcc) TSB92.5(Vcc) TSB93.5(Vcc) TSB94.5(Vcc) TSB95.5(Vcc) TSB96.5(Vcc) TSB97.5(Vcc) TSB98.5(Vcc) TSB99.5(Vcc) TSB100.5(Vcc) TSB101.5(Vcc) TSB102.5(Vcc) TSB103.5(Vcc) TSB104.5(Vcc) TSB105.5(Vcc) TSB106.5(Vcc) TSB107.5(Vcc) TSB108.5(Vcc) TSB109.5(Vcc) TSB110.5(Vcc) TSB111.5(Vcc) TSB112.5(Vcc) TSB113.5(Vcc) TSB114.5(Vcc) TSB115.5(Vcc) TSB116.5(Vcc) TSB117.5(Vcc) TSB118.5(Vcc) TSB119.5(Vcc) TSB126.5(Vcc) ; port TSB_VCC_BANK
Y_B0: TSB1.4(Y)
Y_B1: TSB8.4(Y)
Y_B2: TSB15.4(Y)
Y_B3: TSB22.4(Y)
Y_B4: TSB29.4(Y)
Y_B5: TSB36.4(Y)
Y_B6: TSB43.4(Y)
Y_B7: TSB50.4(Y)
Y_B8: TSB57.4(Y)
Y_B9: TSB64.4(Y)
Y_B10: TSB71.4(Y)
Y_B11: TSB78.4(Y)
Y_B12: TSB85.4(Y)
Y_B13: TSB92.4(Y)
Y_B14: TSB99.4(Y)
Y_B15: TSB106.4(Y)
Y_B16: TSB113.4(Y)
Y_B17: TSB120.4(Y)
Y_B18: TSB2.4(Y)
Y_B19: TSB9.4(Y)
Y_B20: TSB16.4(Y)
Y_B21: TSB23.4(Y)
Y_B22: TSB30.4(Y)
Y_B23: TSB37.4(Y)
Y_B24: TSB44.4(Y)
Y_B25: TSB51.4(Y)
Y_B26: TSB58.4(Y)
Y_B27: TSB65.4(Y)
Y_B28: TSB72.4(Y)
Y_B29: TSB79.4(Y)
Y_B30: TSB86.4(Y)
Y_B31: TSB93.4(Y)
Y_B32: TSB100.4(Y)
Y_B33: TSB107.4(Y)
Y_B34: TSB114.4(Y)
Y_B35: TSB121.4(Y)
Y_B36: TSB3.4(Y)
Y_B37: TSB10.4(Y)
Y_B38: TSB17.4(Y)
Y_B39: TSB24.4(Y)
Y_B40: TSB31.4(Y)
Y_B41: TSB38.4(Y)
Y_B42: TSB45.4(Y)
Y_B43: TSB52.4(Y)
Y_B44: TSB59.4(Y)
Y_B45: TSB66.4(Y)
Y_B46: TSB73.4(Y)
Y_B47: TSB80.4(Y)
Y_B48: TSB87.4(Y)
Y_B49: TSB94.4(Y)
Y_B50: TSB101.4(Y)
Y_B51: TSB108.4(Y)
Y_B52: TSB115.4(Y)
Y_B53: TSB122.4(Y)
Y_B54: TSB4.4(Y)
Y_B55: TSB11.4(Y)
Y_B56: TSB18.4(Y)
Y_B57: TSB25.4(Y)
Y_B58: TSB32.4(Y)
Y_B59: TSB39.4(Y)
Y_B60: TSB46.4(Y)
Y_B61: TSB53.4(Y)
Y_B62: TSB60.4(Y)
Y_B63: TSB67.4(Y)
Y_B64: TSB74.4(Y)
Y_B65: TSB81.4(Y)
Y_B66: TSB88.4(Y)
Y_B67: TSB95.4(Y)
Y_B68: TSB102.4(Y)
Y_B69: TSB109.4(Y)
Y_B70: TSB116.4(Y)
Y_B71: TSB123.4(Y)
Y_B72: TSB5.4(Y)
Y_B73: TSB12.4(Y)
Y_B74: TSB19.4(Y)
Y_B75: TSB26.4(Y)
Y_B76: TSB33.4(Y)
Y_B77: TSB40.4(Y)
Y_B78: TSB47.4(Y)
Y_B79: TSB54.4(Y)
Y_B80: TSB61.4(Y)
Y_B81: TSB68.4(Y)
Y_B82: TSB75.4(Y)
Y_B83: TSB82.4(Y)
Y_B84: TSB89.4(Y)
Y_B85: TSB96.4(Y)
Y_B86: TSB103.4(Y)
Y_B87: TSB110.4(Y)
Y_B88: TSB117.4(Y)
Y_B89: TSB124.4(Y)
Y_B90: TSB6.4(Y)
Y_B91: TSB13.4(Y)
Y_B92: TSB20.4(Y)
Y_B93: TSB27.4(Y)
Y_B94: TSB34.4(Y)
Y_B95: TSB41.4(Y)
Y_B96: TSB48.4(Y)
Y_B97: TSB55.4(Y)
Y_B98: TSB62.4(Y)
Y_B99: TSB69.4(Y)
Y_B100: TSB76.4(Y)
Y_B101: TSB83.4(Y)
Y_B102: TSB90.4(Y)
Y_B103: TSB97.4(Y)
Y_B104: TSB104.4(Y)
Y_B105: TSB111.4(Y)
Y_B106: TSB118.4(Y)
Y_B107: TSB125.4(Y)
Y_B108: TSB7.4(Y)
Y_B109: TSB14.4(Y)
Y_B110: TSB21.4(Y)
Y_B111: TSB28.4(Y)
Y_B112: TSB35.4(Y)
Y_B113: TSB42.4(Y)
Y_B114: TSB49.4(Y)
Y_B115: TSB56.4(Y)
Y_B116: TSB63.4(Y)
Y_B117: TSB70.4(Y)
Y_B118: TSB77.4(Y)
Y_B119: TSB84.4(Y)
Y_B120: TSB91.4(Y)
Y_B121: TSB98.4(Y)
Y_B122: TSB105.4(Y)
Y_B123: TSB112.4(Y)
Y_B124: TSB119.4(Y)
Y_B125: TSB126.4(Y)
Y_B126: TSB127.4(Y)
Y_B127: TSB128.4(Y)
~OE_B0: TSB1.1(~OE)
~OE_B1: TSB8.1(~OE)
~OE_B2: TSB15.1(~OE)
~OE_B3: TSB22.1(~OE)
~OE_B4: TSB29.1(~OE)
~OE_B5: TSB36.1(~OE)
~OE_B6: TSB43.1(~OE)
~OE_B7: TSB50.1(~OE)
~OE_B8: TSB57.1(~OE)
~OE_B9: TSB64.1(~OE)
~OE_B10: TSB71.1(~OE)
~OE_B11: TSB78.1(~OE)
~OE_B12: TSB85.1(~OE)
~OE_B13: TSB92.1(~OE)
~OE_B14: TSB99.1(~OE)
~OE_B15: TSB106.1(~OE)
~OE_B16: TSB113.1(~OE)
~OE_B17: TSB120.1(~OE)
~OE_B18: TSB2.1(~OE)
~OE_B19: TSB9.1(~OE)
~OE_B20: TSB16.1(~OE)
~OE_B21: TSB23.1(~OE)
~OE_B22: TSB30.1(~OE)
~OE_B23: TSB37.1(~OE)
~OE_B24: TSB44.1(~OE)
~OE_B25: TSB51.1(~OE)
~OE_B26: TSB58.1(~OE)
~OE_B27: TSB65.1(~OE)
~OE_B28: TSB72.1(~OE)
~OE_B29: TSB79.1(~OE)
~OE_B30: TSB86.1(~OE)
~OE_B31: TSB93.1(~OE)
~OE_B32: TSB100.1(~OE)
~OE_B33: TSB107.1(~OE)
~OE_B34: TSB114.1(~OE)
~OE_B35: TSB121.1(~OE)
~OE_B36: TSB3.1(~OE)
~OE_B37: TSB10.1(~OE)
~OE_B38: TSB17.1(~OE)
~OE_B39: TSB24.1(~OE)
~OE_B40: TSB31.1(~OE)
~OE_B41: TSB38.1(~OE)
~OE_B42: TSB45.1(~OE)
~OE_B43: TSB52.1(~OE)
~OE_B44: TSB59.1(~OE)
~OE_B45: TSB66.1(~OE)
~OE_B46: TSB73.1(~OE)
~OE_B47: TSB80.1(~OE)
~OE_B48: TSB87.1(~OE)
~OE_B49: TSB94.1(~OE)
~OE_B50: TSB101.1(~OE)
~OE_B51: TSB108.1(~OE)
~OE_B52: TSB115.1(~OE)
~OE_B53: TSB122.1(~OE)
~OE_B54: TSB4.1(~OE)
~OE_B55: TSB11.1(~OE)
~OE_B56: TSB18.1(~OE)
~OE_B57: TSB25.1(~OE)
~OE_B58: TSB32.1(~OE)
~OE_B59: TSB39.1(~OE)
~OE_B60: TSB46.1(~OE)
~OE_B61: TSB53.1(~OE)
~OE_B62: TSB60.1(~OE)
~OE_B63: TSB67.1(~OE)
~OE_B64: TSB74.1(~OE)
~OE_B65: TSB81.1(~OE)
~OE_B66: TSB88.1(~OE)
~OE_B67: TSB95.1(~OE)
~OE_B68: TSB102.1(~OE)
~OE_B69: TSB109.1(~OE)
~OE_B70: TSB116.1(~OE)
~OE_B71: TSB123.1(~OE)
~OE_B72: TSB5.1(~OE)
~OE_B73: TSB12.1(~OE)
~OE_B74: TSB19.1(~OE)
~OE_B75: TSB26.1(~OE)
~OE_B76: TSB33.1(~OE)
~OE_B77: TSB40.1(~OE)
~OE_B78: TSB47.1(~OE)
~OE_B79: TSB54.1(~OE)
~OE_B80: TSB61.1(~OE)
~OE_B81: TSB68.1(~OE)
~OE_B82: TSB75.1(~OE)
~OE_B83: TSB82.1(~OE)
~OE_B84: TSB89.1(~OE)
~OE_B85: TSB96.1(~OE)
~OE_B86: TSB103.1(~OE)
~OE_B87: TSB110.1(~OE)
~OE_B88: TSB117.1(~OE)
~OE_B89: TSB124.1(~OE)
~OE_B90: TSB6.1(~OE)
~OE_B91: TSB13.1(~OE)
~OE_B92: TSB20.1(~OE)
~OE_B93: TSB27.1(~OE)
~OE_B94: TSB34.1(~OE)
~OE_B95: TSB41.1(~OE)
~OE_B96: TSB48.1(~OE)
~OE_B97: TSB55.1(~OE)
~OE_B98: TSB62.1(~OE)
~OE_B99: TSB69.1(~OE)
~OE_B100: TSB76.1(~OE)
~OE_B101: TSB83.1(~OE)
~OE_B102: TSB90.1(~OE)
~OE_B103: TSB97.1(~OE)
~OE_B104: TSB104.1(~OE)
~OE_B105: TSB111.1(~OE)
~OE_B106: TSB118.1(~OE)
~OE_B107: TSB125.1(~OE)
~OE_B108: TSB7.1(~OE)
~OE_B109: TSB14.1(~OE)
~OE_B110: TSB21.1(~OE)
~OE_B111: TSB28.1(~OE)
~OE_B112: TSB35.1(~OE)
~OE_B113: TSB42.1(~OE)
~OE_B114: TSB49.1(~OE)
~OE_B115: TSB56.1(~OE)
~OE_B116: TSB63.1(~OE)
~OE_B117: TSB70.1(~OE)
~OE_B118: TSB77.1(~OE)
~OE_B119: TSB84.1(~OE)
~OE_B120: TSB91.1(~OE)
~OE_B121: TSB98.1(~OE)
~OE_B122: TSB105.1(~OE)
~OE_B123: TSB112.1(~OE)
~OE_B124: TSB119.1(~OE)
~OE_B125: TSB126.1(~OE)
~OE_B126: TSB127.1(~OE)
~OE_B127: TSB128.1(~OE)

Not connected (* = marked no-connect by the designer): TSB120 5(Vcc); TSB121 5(Vcc); TSB122 3(GND) 5(Vcc); TSB123 5(Vcc); TSB124 5(Vcc); TSB125 5(Vcc); TSB127 5(Vcc); TSB128 5(Vcc)

## Buses and harness runs
bus A_B[15..0] = port A_BANK[15..0]
bus A_B[31..16] = port A_BANK[31..16]
bus A_B[47..32] = port A_BANK[47..32]
bus A_B[63..48] = port A_BANK[63..48]
bus A_B[79..64] = port A_BANK[79..64]
bus A_B[95..80] = port A_BANK[95..80]
bus A_B[111..96] = port A_BANK[111..96]
bus A_B[125..112] = port A_BANK[125..112]
bus Y_B[15..0] = port Y_BANK[15..0]
bus Y_B[31..16] = port Y_BANK[31..16]
bus Y_B[47..32] = port Y_BANK[47..32]
bus Y_B[63..48] = port Y_BANK[63..48]
bus Y_B[79..64] = port Y_BANK[79..64]
bus Y_B[95..80] = port Y_BANK[95..80]
bus Y_B[111..96] = port Y_BANK[111..96]
bus Y_B[127..112] = port Y_BANK[127..112]
bus ~OE_B[15..0] = port ~OE_BANK[15..0]
bus ~OE_B[31..16] = port ~OE_BANK[31..16]
bus ~OE_B[47..32] = port ~OE_BANK[47..32]
bus ~OE_B[63..48] = port ~OE_BANK[63..48]
bus ~OE_B[79..64] = port ~OE_BANK[79..64]
bus ~OE_B[95..80] = port ~OE_BANK[95..80]
bus ~OE_B[111..96] = port ~OE_BANK[111..96]
bus ~OE_B[127..112] = port ~OE_BANK[127..112]

## Library data of the parts
TSB1-TSB128 = Tri-State Buffer Non-Inverting: IC BUFF DVR TRI-ST N-INV 5TSSOP; Manufacturer: NXP Semiconductors; Manufacturer Part Number: 74LVC1G125GW,125; Logic Type: Buffer/Line Driver, Non-Inverting; Number of Elements: 1; Current - Output High, Low: 32mA, 32mA; Voltage - Supply: 1.65 V ~ 5.5 V; Supplier 1: Digi-Key; RoHS: RoHS Compliant; Category: Integrated Circuits (ICs); Stock 1: 56738; Pricing 1: 1=0.29, 10=0.235, 100=0.1244, 500=0.08184, 1000=0.05576 (USD); Packaging: Cut Tape (CT); Number of Bits per Element: 1; Operating Temperature: -40°C ~ 125°C; Mounting Type: Surface Mount; Package / Case: 5-TSSOP, SC-70-5, SOT-353; Supplier Device Package: 5-TSSOP; ComponentLink1URL: http://www.nxp.com/documents/data_sheet/74LVC1G125.pdf; ComponentLink1Description: http://www.nxp.com/documents/data_sheet/74LVC1G125.pdf; Supplier Part Number 1: 568-3005-1-ND